# EasyEDA Pro project ProProject_ESP32-S3 Brewpiless V1 Rev 1_2024-01-04.epro

# Schematic esp32 brewpiless

## Sheets
1 ESP32
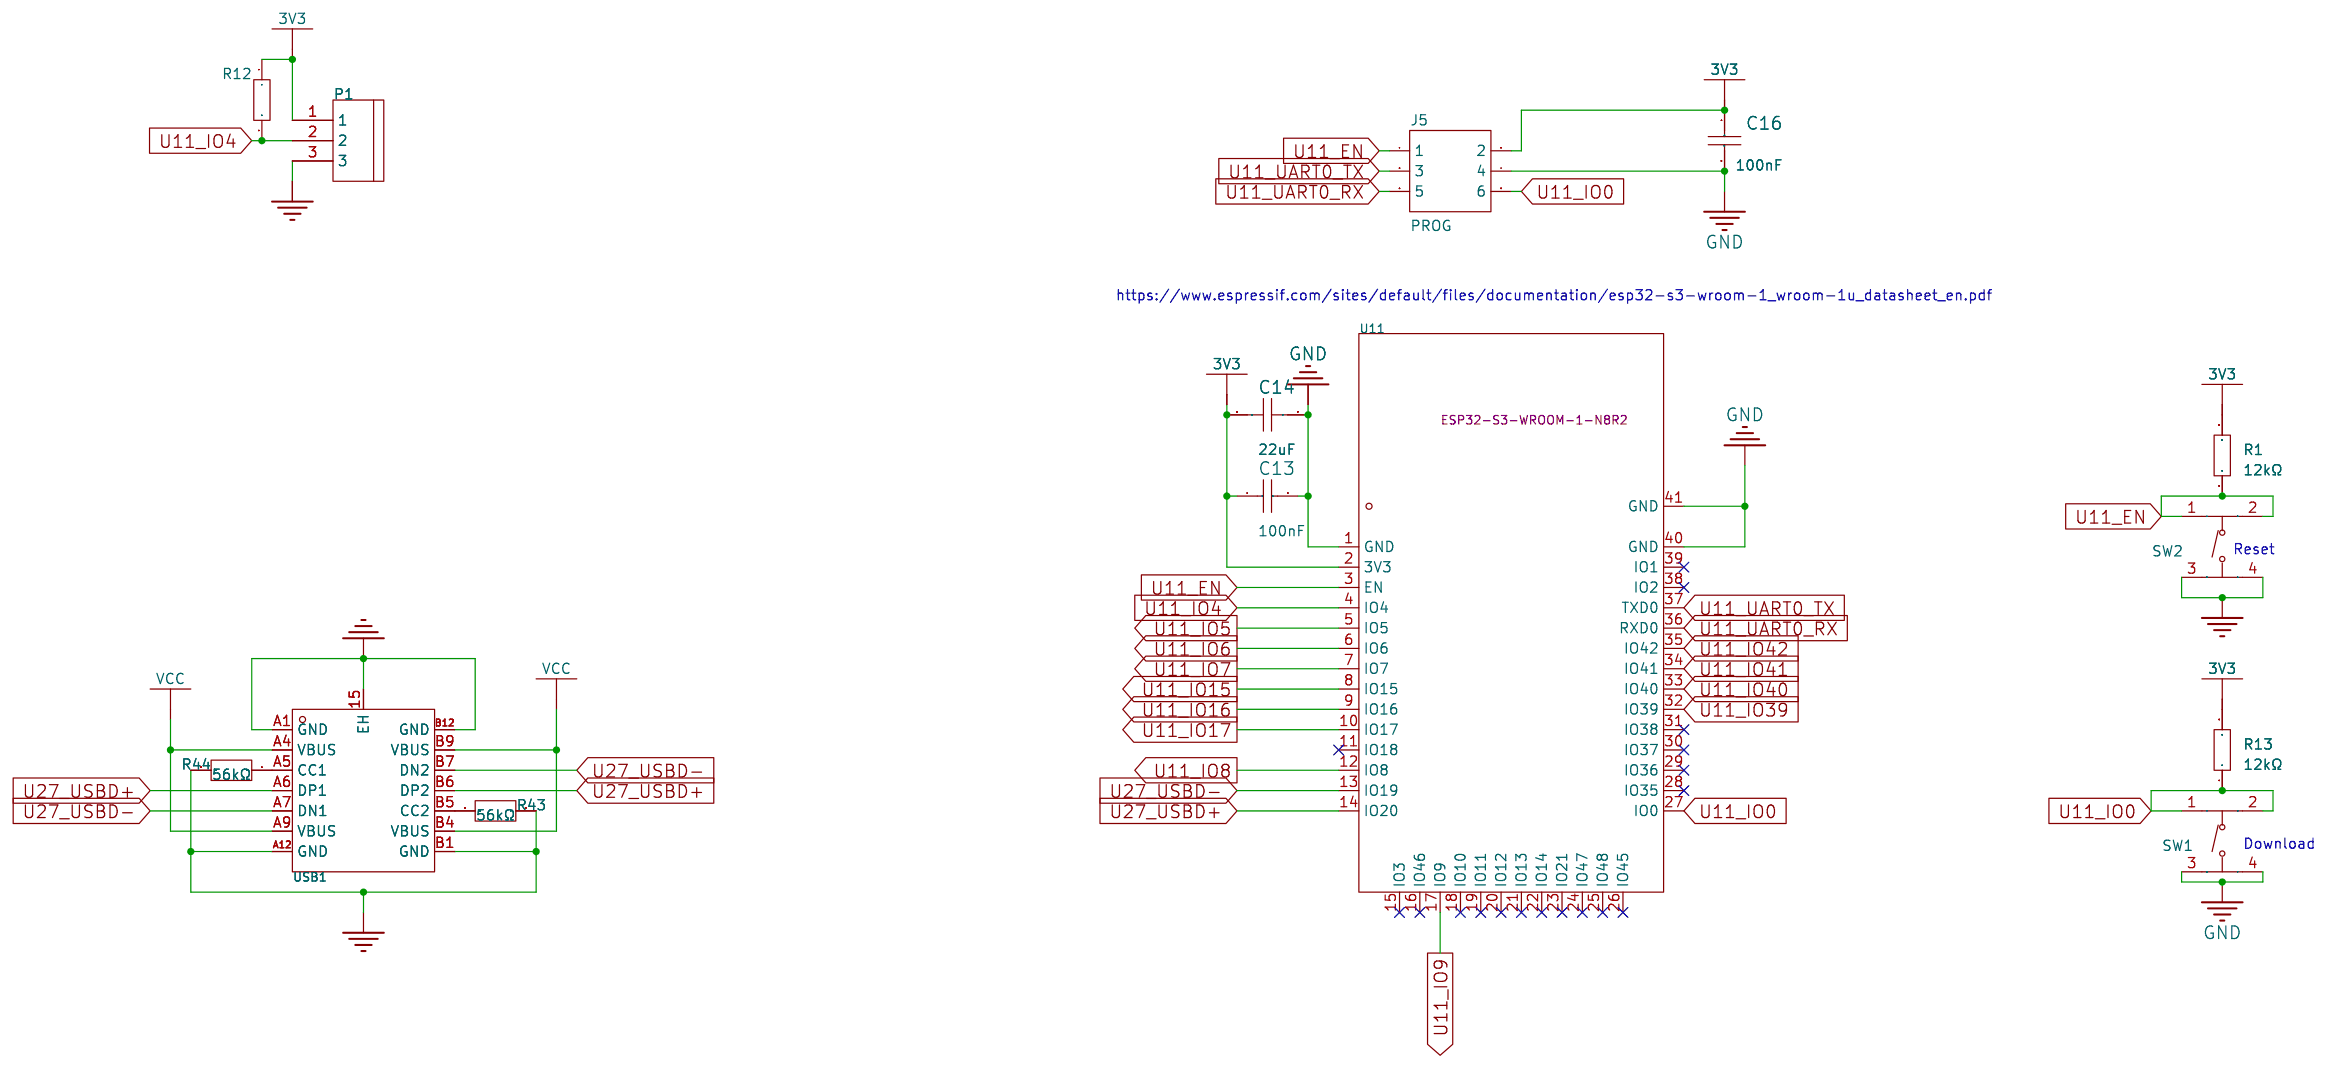
[diagram p0: ESP32]
2 Mains: Create Date: 2023-09-11; Page Name: Mains; Project Name: ESP8266 Brewpiless c6; Schematic Name: ESP32 Brewpiless; Update Date: 2024-01-02; Company: EasyEDA.com; Drawed: EasyEDAPro; Page Size: A4; Part Number: JLCPCB-002; Reviewed: EasyEDAPro; Version: V0.1
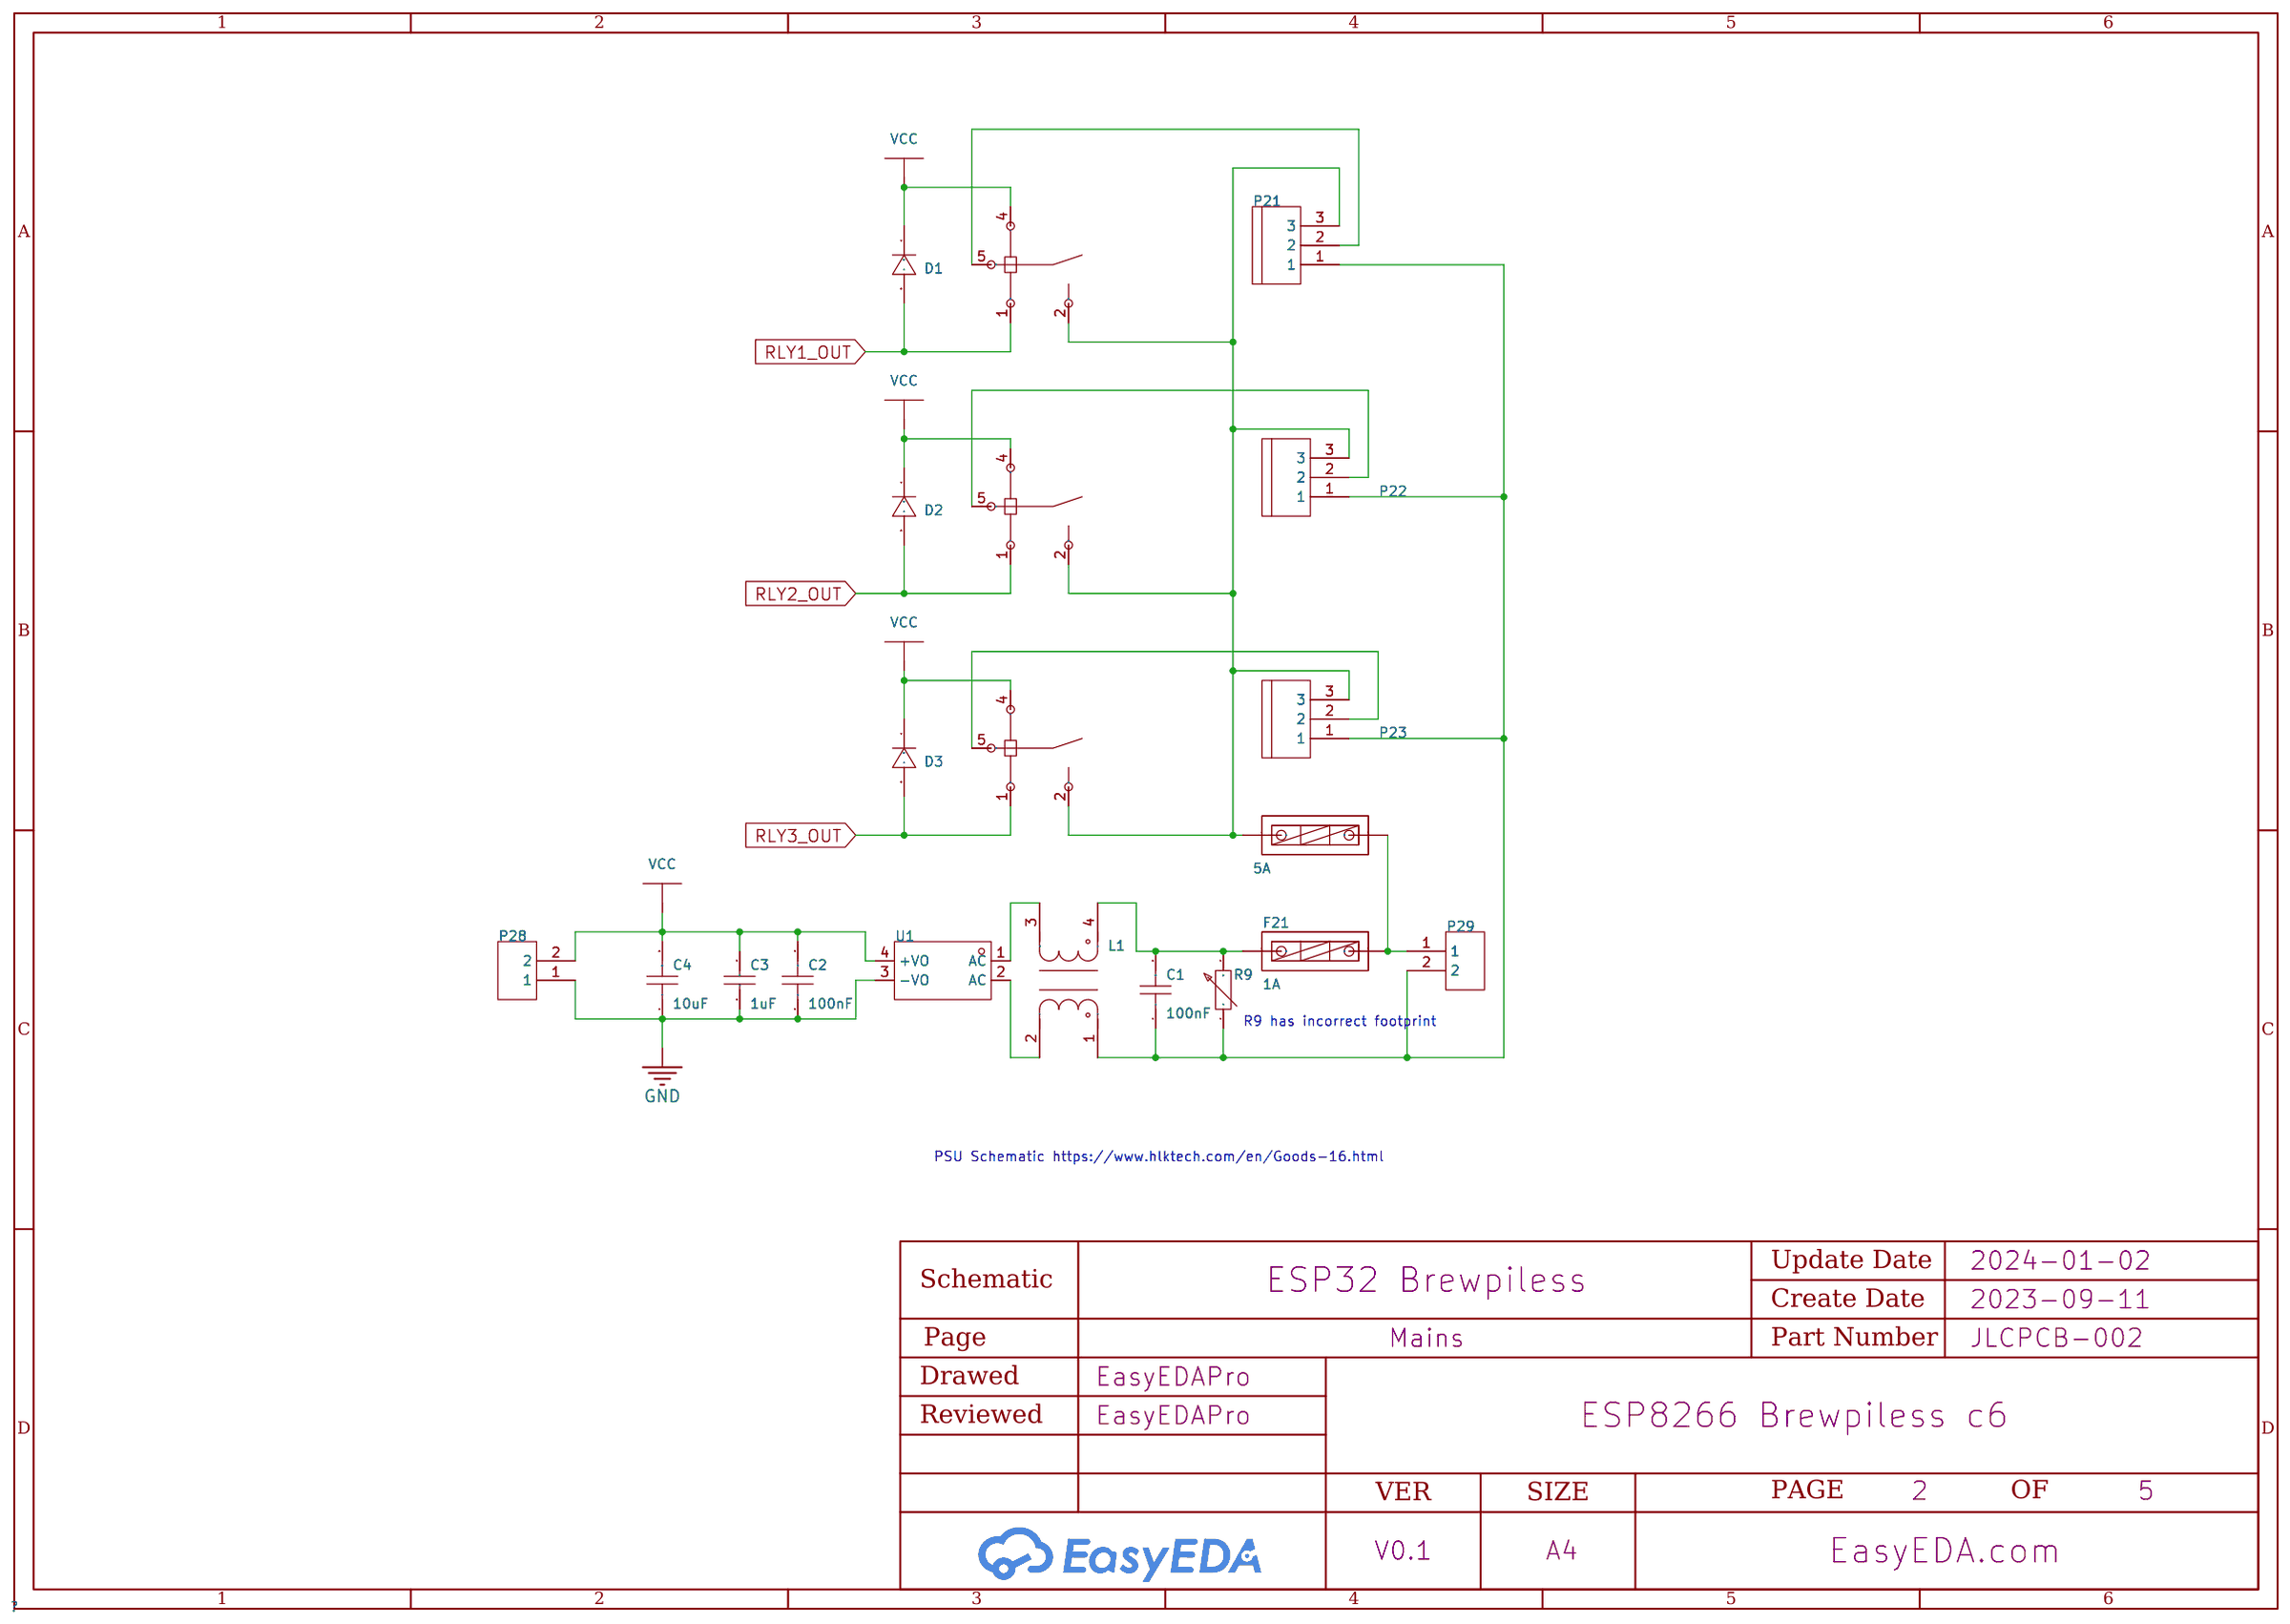
[diagram p1: Mains]
3 LevelShifter: Create Date: 2024-01-03; Page Name: LevelShifter; Project Name: ESP32-S3 Brewpiless V1 Rev 1; Schematic Name: esp32 brewpiless; Update Date: 2024-01-03; Company: EasyEDA.com; Drawed: EasyEDAPro; Page Size: A4; Part Number: JLCPCB-002; Reviewed: EasyEDAPro; Version: V0.1
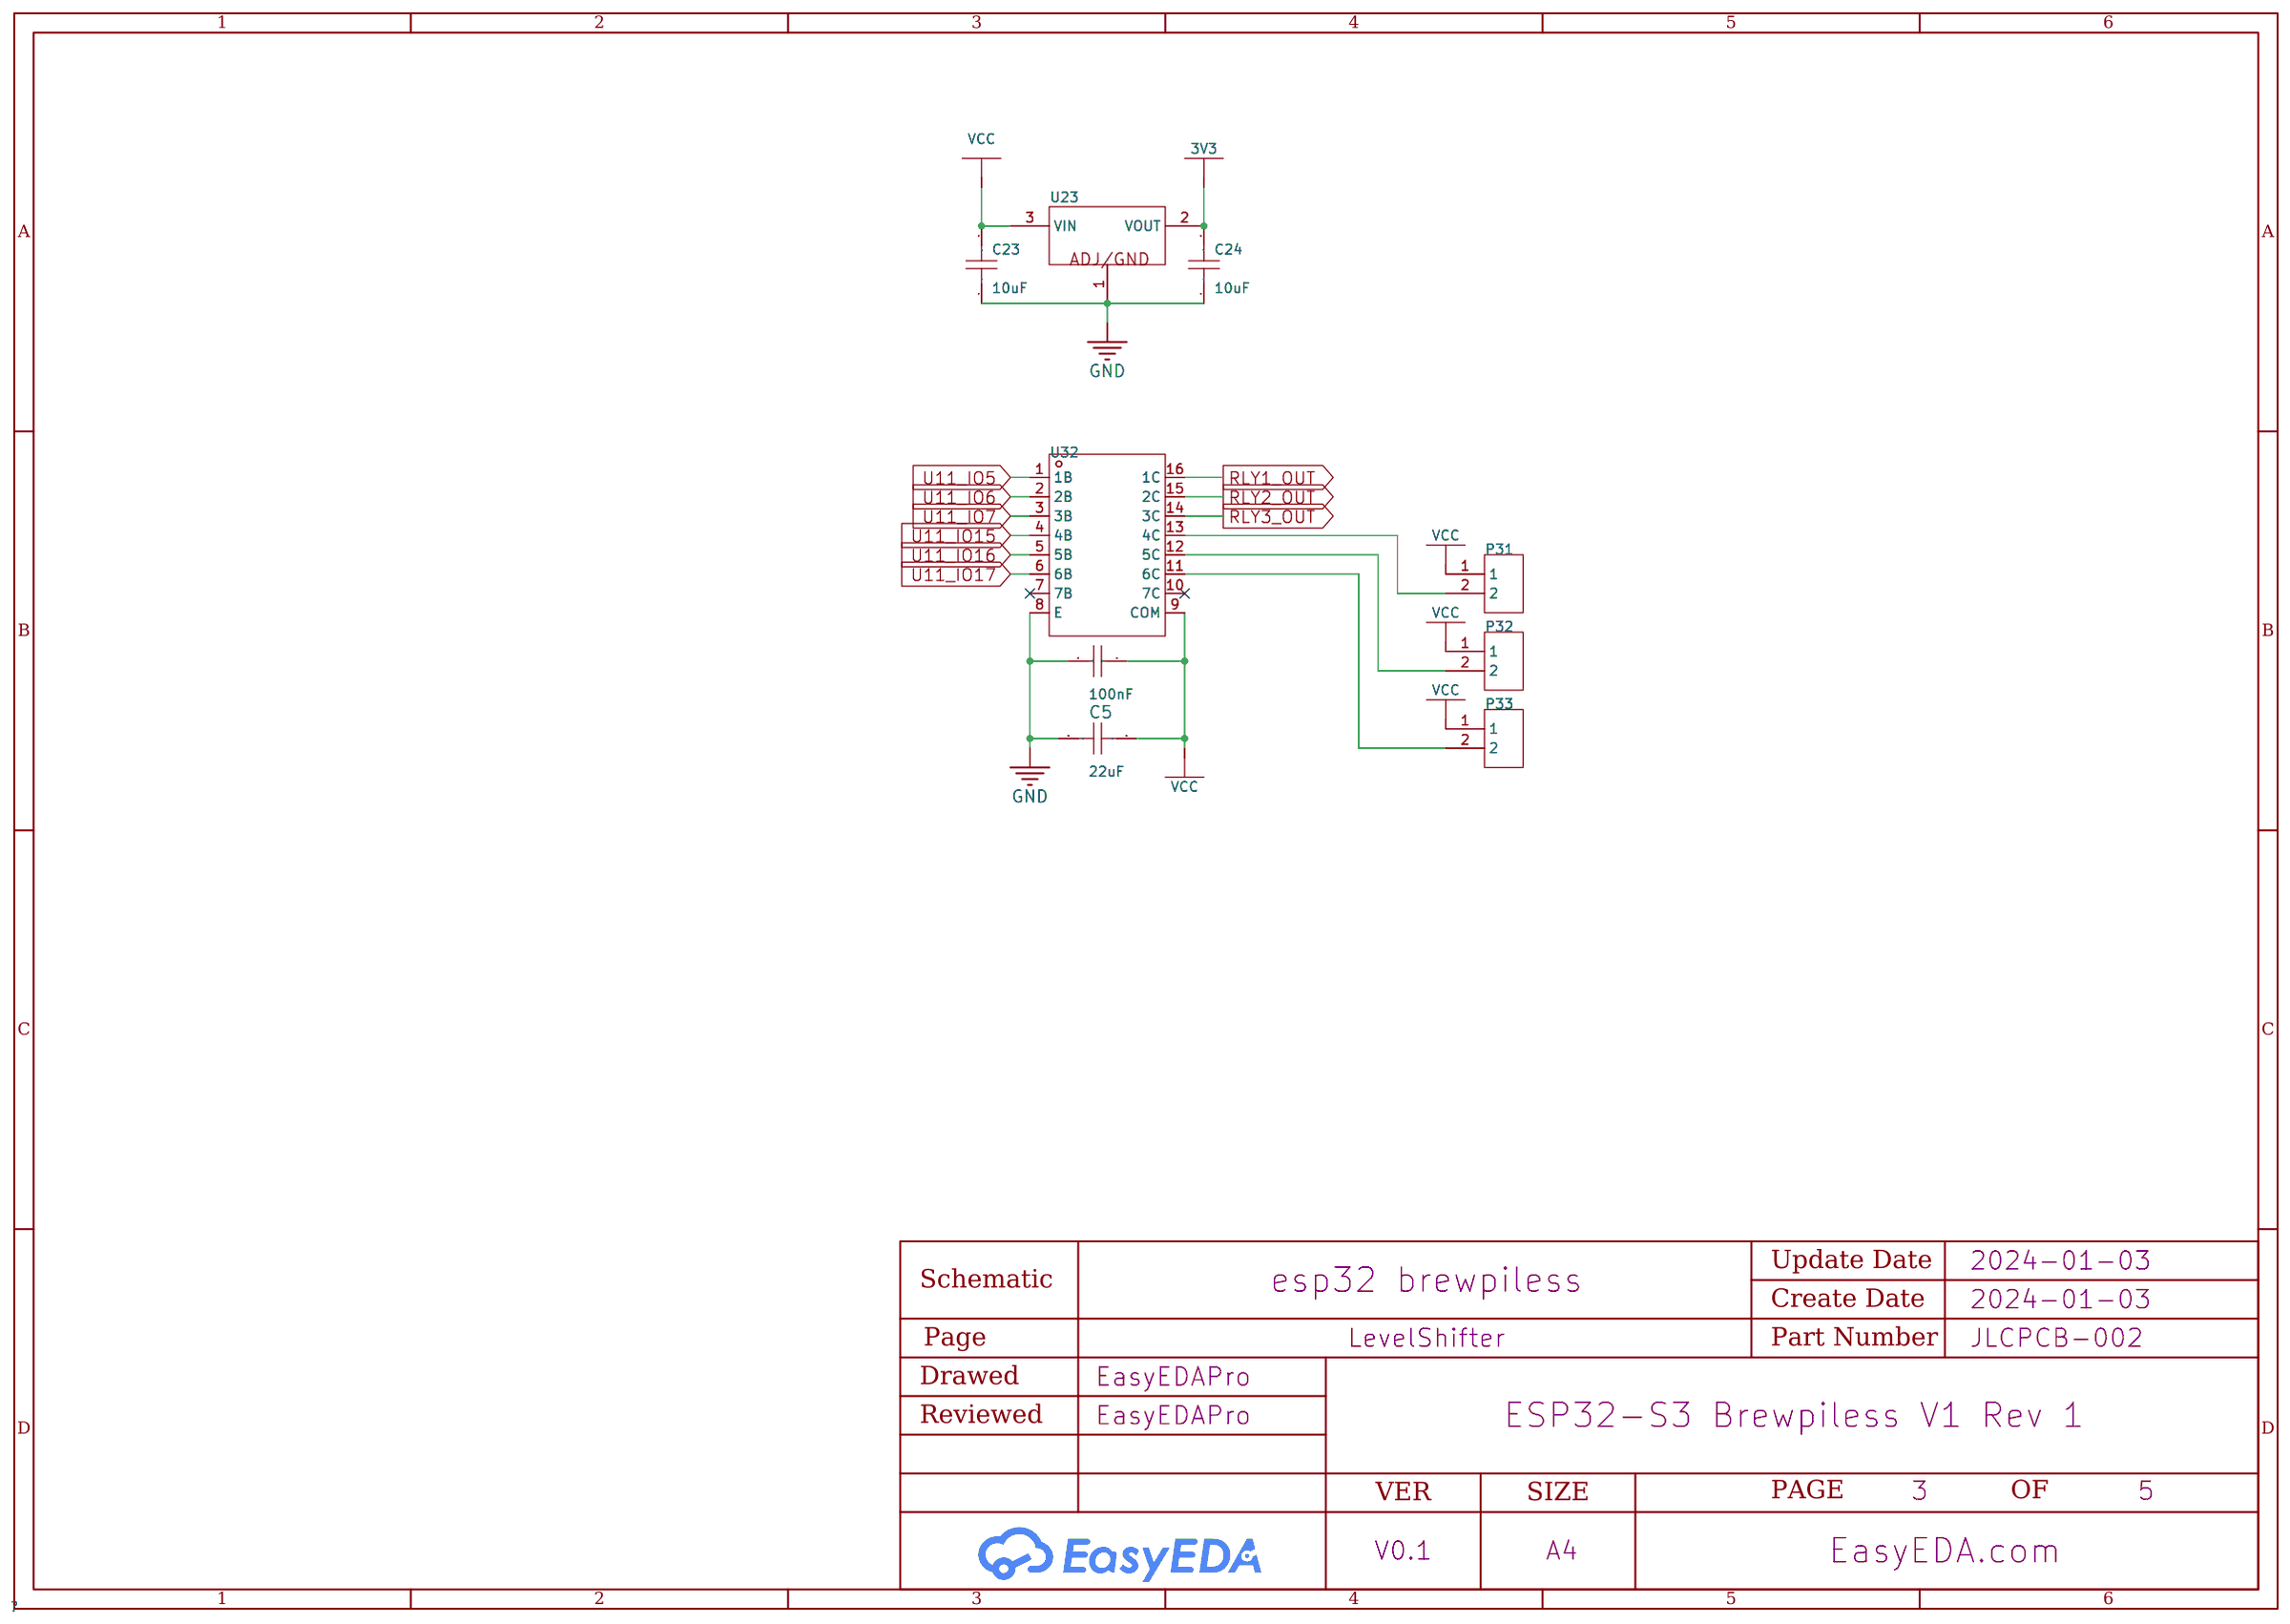
[diagram p2: LevelShifter]
4 RTD: Create Date: 2024-01-01; Page Name: RTD; Project Name: ESP8266 Brewpiless c6; Schematic Name: ESP32 Brewpiless; Update Date: 2024-01-02; Company: EasyEDA.com; Drawed: EasyEDA Pro; Page Size: A4; Part Number: JLCPCB-002; Reviewed: EasyEDA Pro; Version: V0.1
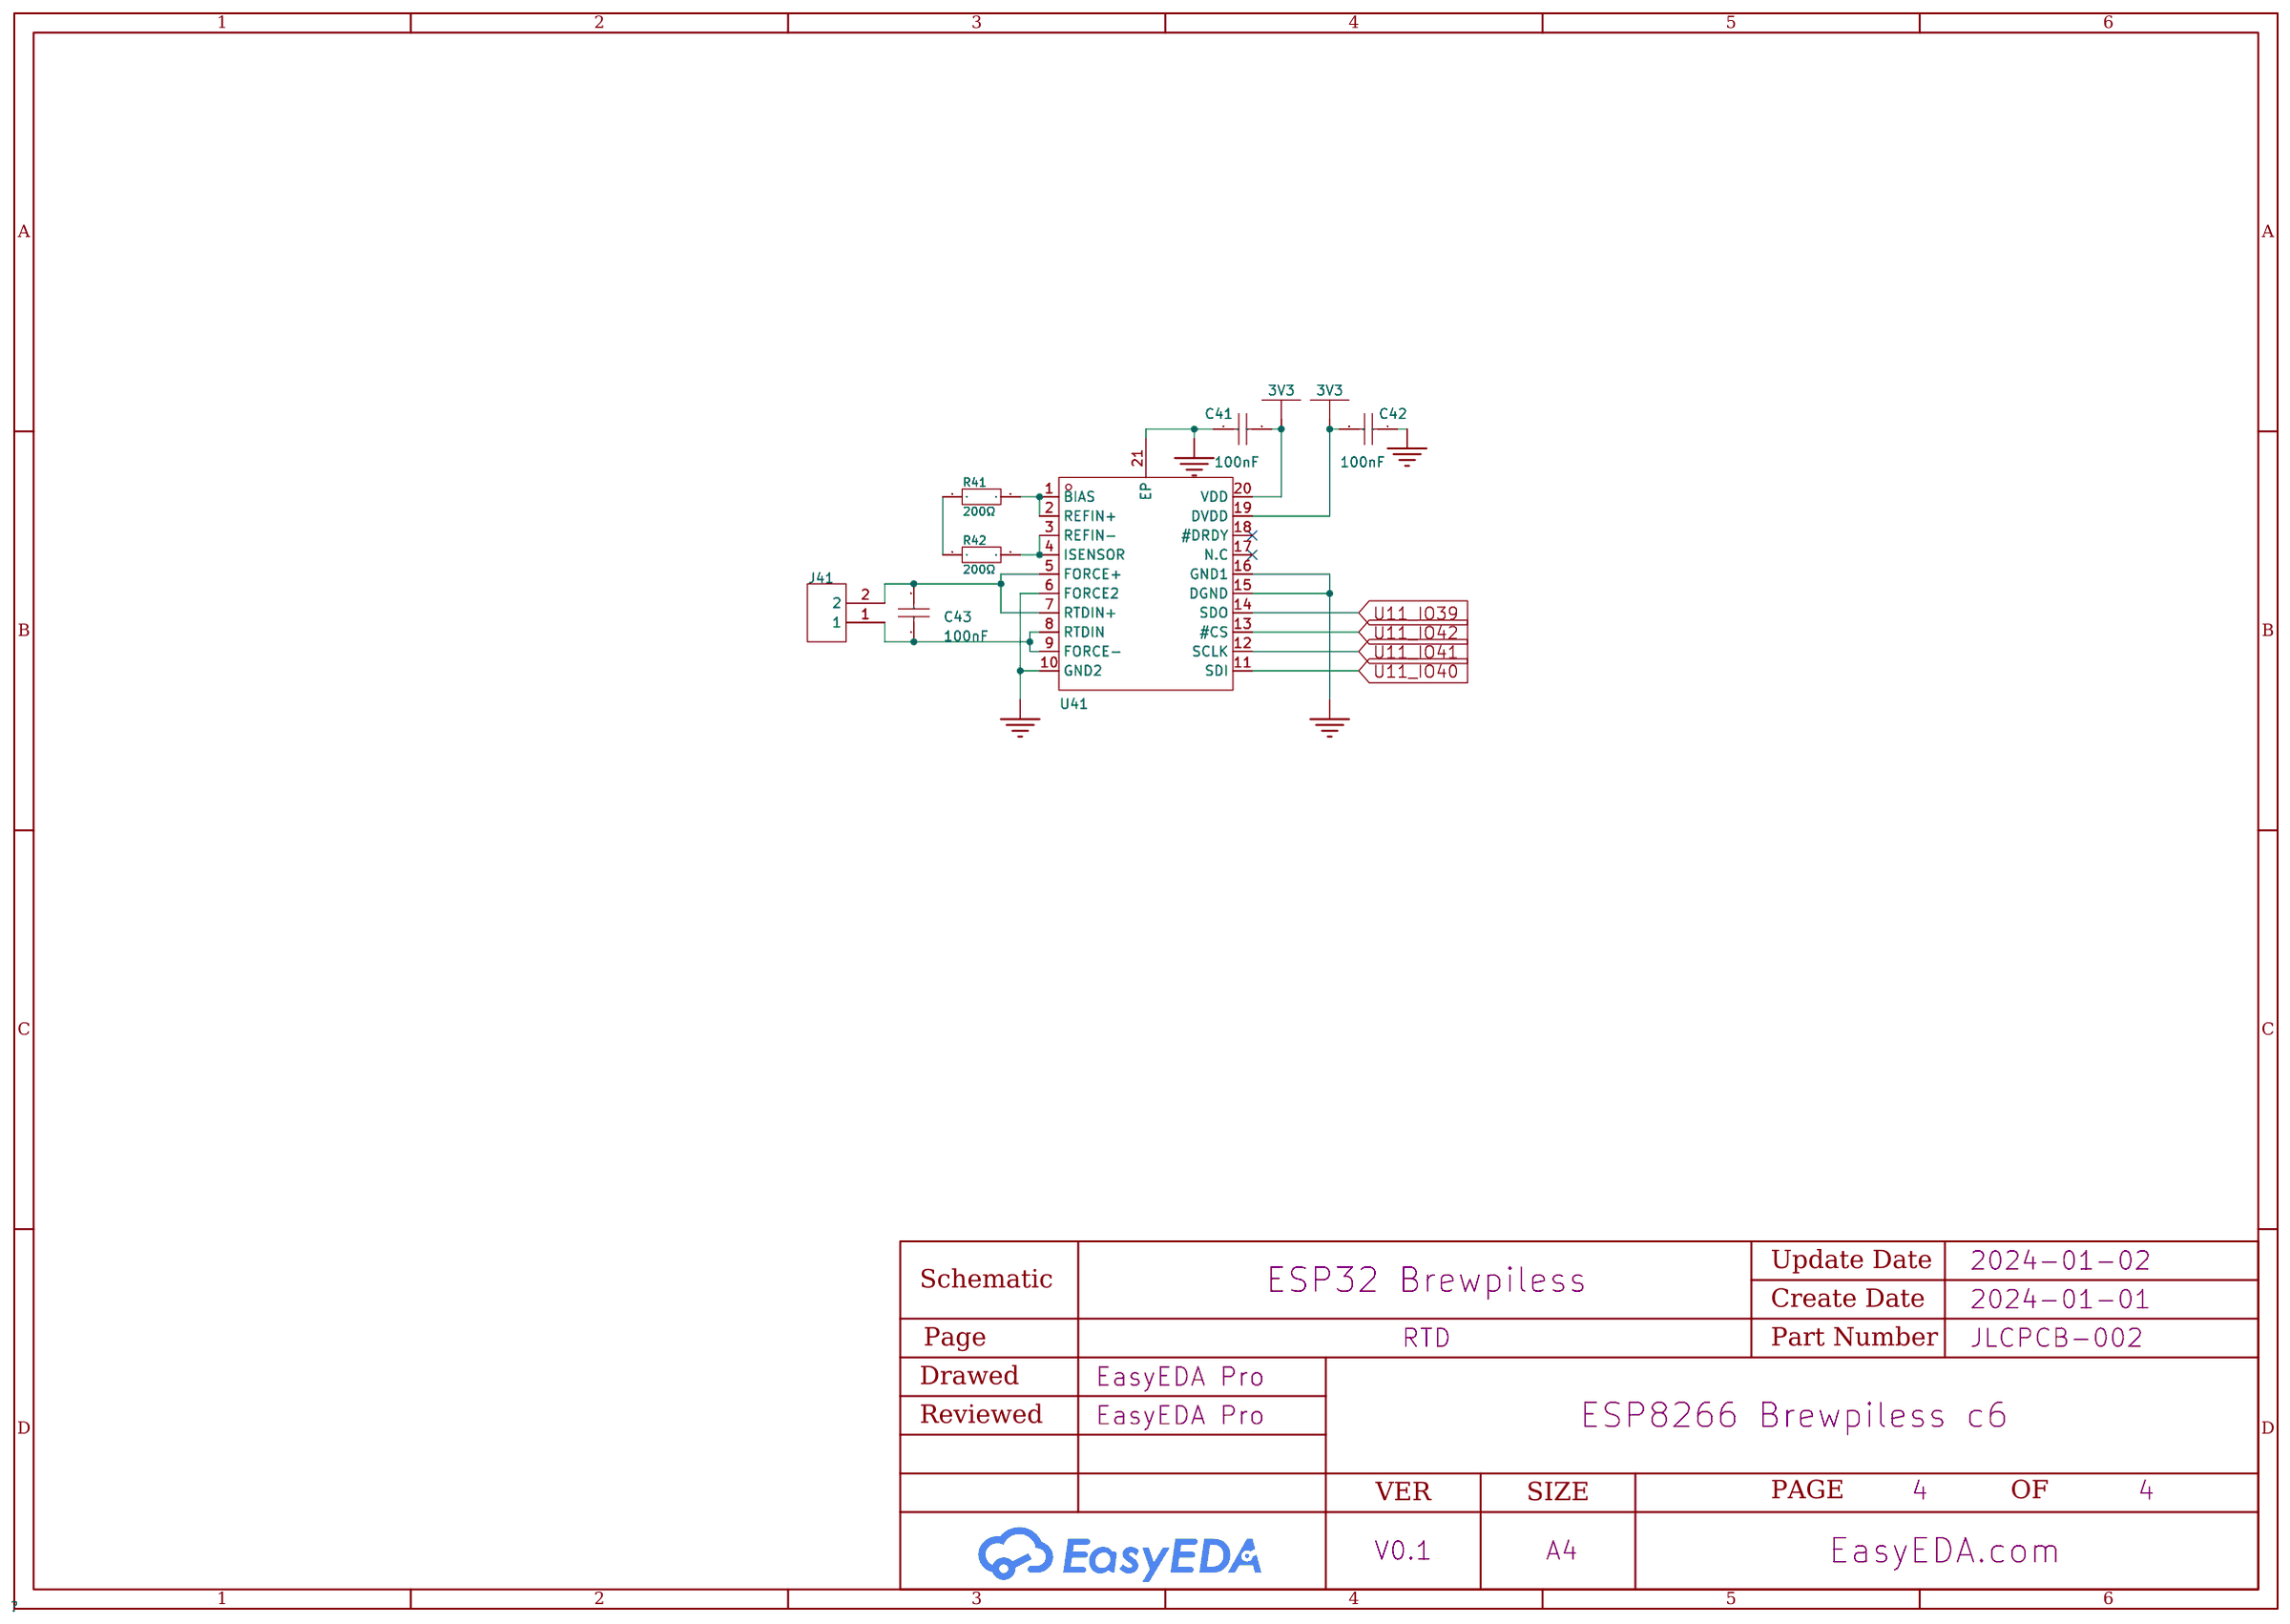
[diagram p3: RTD]
5 ATEC: Create Date: 2024-01-02; Page Name: ATEC; Project Name: ESP8266 Brewpiless c6; Schematic Name: ESP32 Brewpiless; Update Date: 2024-01-02; Company: EasyEDA.com; Drawed: EasyEDA Pro; Page Size: A4; Part Number: JLCPCB-002; Reviewed: EasyEDA Pro; Version: V0.1
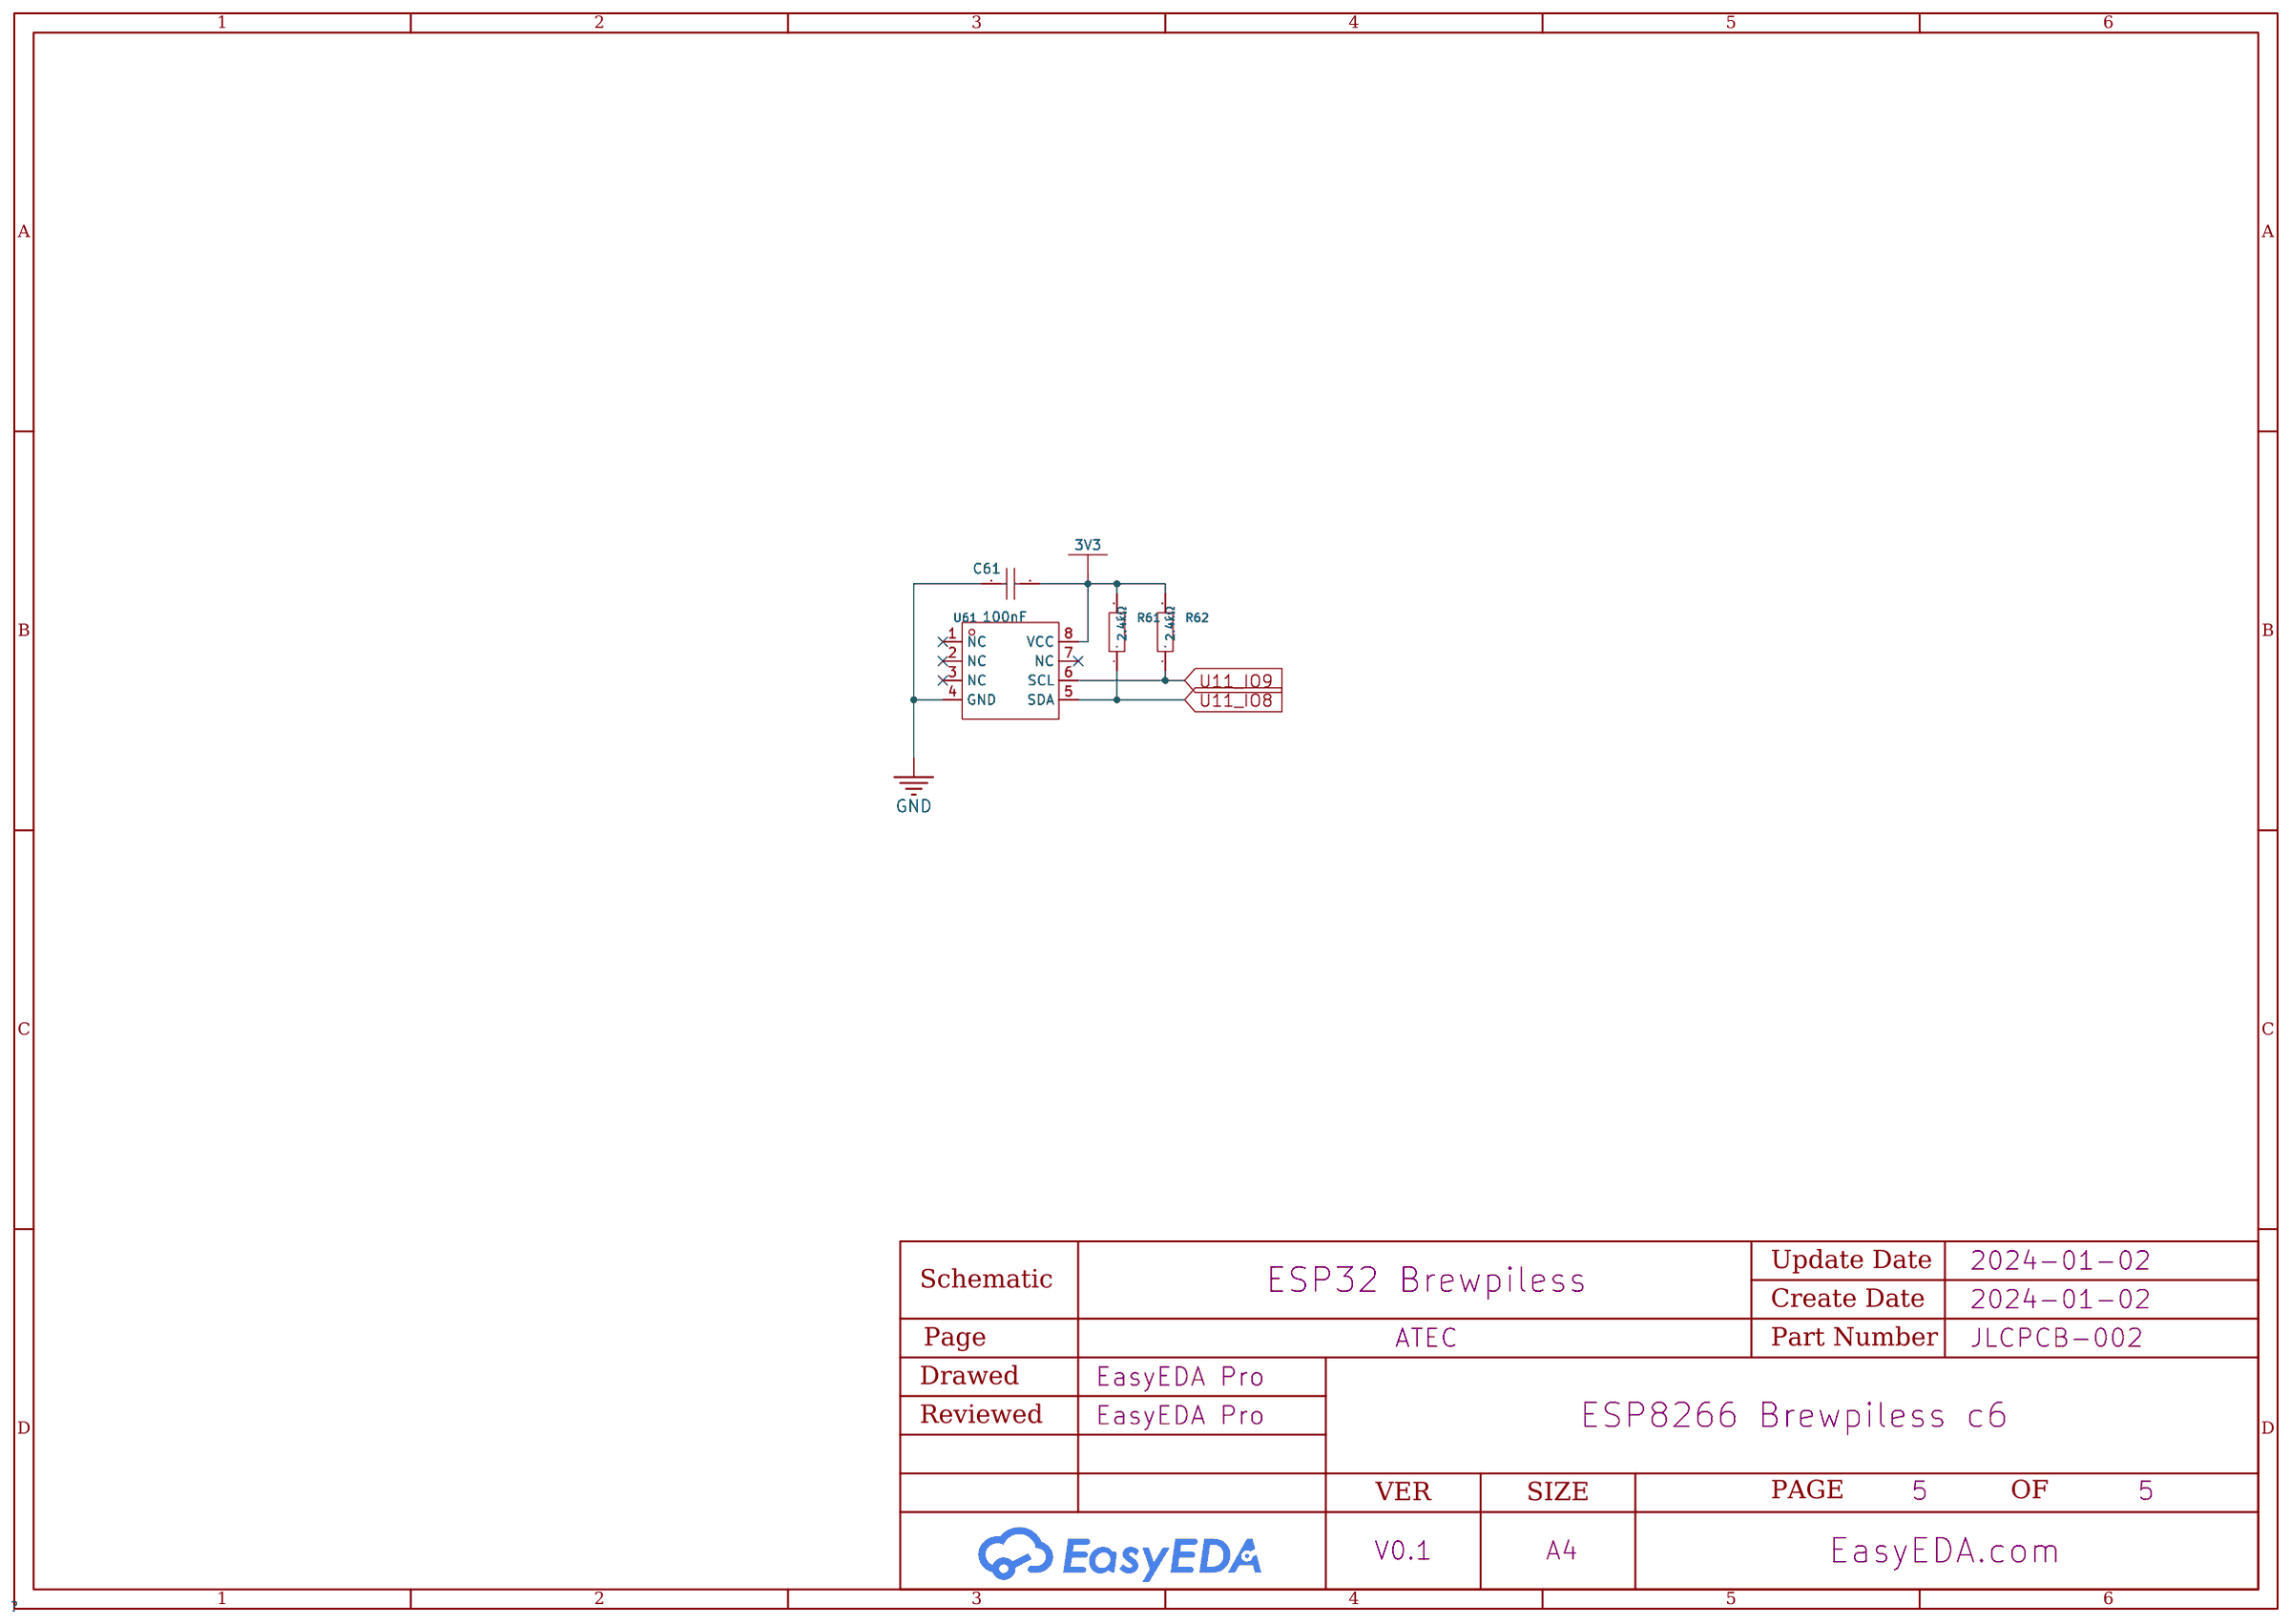
[diagram p4: ATEC]

## Parts
sheet ATEC
C61  100nF  [C0805]
R61  2.4kΩ  [R0805]
R62  2.4kΩ  [R0805]
U61  ATECC608A-SSHDA-T  [SOIC-8_L4.9-W3.9-P1.27-LS6.0-BL]
sheet ESP32
C13  100nF  [C0805]
C14  22uF  [C0805]
C16  100nF  [C0805]
J5  PROG  [IDC-TH_6P-P2.54_C11214]
P1  WJ500V-5.08-3P  [CONN-TH_3P-P5.00_WJ500V-5.08-3P]
R1  12kΩ  [R0805]
R12  4.7kΩ  [R0805]
R13  12kΩ  [R0805]
R43  56kΩ  [R0805]
R44  56kΩ  [R0805]
SW1  TS-1187A-B-A-B  [SW-SMD_4P-L5.1-W5.1-P3.70-LS6.5-TL-2]
SW2  TS-1187A-B-A-B  [SW-SMD_4P-L5.1-W5.1-P3.70-LS6.5-TL-2]
U11  2.4GHz  [WIRELM-SMD_ESP32-S3-WROOM-1]
USB1  TYPE-C 14P LTH10.0  [TYPE-C-SMD_918-468K2029Y50001]
sheet LevelShifter
C5  22uF  [C0805]
C22  100nF  [C0805]
C23  10uF  [C0805]
C24  10uF  [C0805]
P31  WJ500V-5.08-2P  [CONN-TH_2P-P5.00_WJ500V-5.08-2P]
P32  WJ500V-5.08-2P  [CONN-TH_2P-P5.00_WJ500V-5.08-2P]
P33  WJ500V-5.08-2P  [CONN-TH_2P-P5.00_WJ500V-5.08-2P]
U23  -  [TO-252-2_L6.6-W6.1-P4.57-LS9.9-TL-CW]
U32  -  [SOIC-16_L9.9-W3.9-P1.27-LS6.0-BL]
sheet Mains
C1  100nF  [CAP-TH_L12.0-W5.5-P10.00-D0.6]
C2  100nF  [CAP-TH_L12.0-W5.5-P10.00-D0.6]
C3  1uF  [C0805]
C4  10uF  [C0805]
D1  SM4007PL  [SOD-123F_L2.8-W1.8-LS3.7-RD]
D2  SM4007PL  [SOD-123F_L2.8-W1.8-LS3.7-RD]
D3  SM4007PL  [SOD-123F_L2.8-W1.8-LS3.7-RD]
F21  -  [FUSE-TH_5X20RHOSFUSECLIP-SEAT]
F22  5A  [FUSE-TH_5X20RHOSFUSECLIP-SEAT]
F210  1A  [FUSE-TH_5X20RHOSFUSECLIP-SEAT]
F220  10A  [FUSE-TH_5X20RHOSFUSECLIP-SEAT]
K1  -  [RELAY-TH_973-XXVDC-SL-A]
K2  -  [RELAY-TH_973-XXVDC-SL-A]
K3  -  [RELAY-TH_973-XXVDC-SL-A]
L1  -  [FILTER-TH_UU10.5Y-10MH]
P21  WJ500V-5.08-3P  [CONN-TH_3P-P5.00_WJ500V-5.08-3P]
P22  WJ500V-5.08-3P  [CONN-TH_3P-P5.00_WJ500V-5.08-3P]
P23  WJ500V-5.08-3P  [CONN-TH_3P-P5.00_WJ500V-5.08-3P]
P28  WJ500V-5.08-2P  [CONN-TH_2P-P5.00_WJ500V-5.08-2P]
P29  WJ500V-5.08-2P  [CONN-TH_2P-P5.00_WJ500V-5.08-2P]
R9  10D561K  [RES-TH_L13.0-W6.0-P7.50-D0.9-S6.00]
U1  -  [PWRM-TH_HLK-5M05]
sheet RTD
C41  100nF  [C0805]
C42  100nF  [C0805]
C43  100nF  [C0805]
J41  WJ500V-5.08-2P  [CONN-TH_2P-P5.00_WJ500V-5.08-2P]
R41  200Ω  [R0805]
R42  200Ω  [R0805]
U41  MAX31865ATP+T  [QFN-20_L5.0-W5.0-P0.65-BL-EP]

## Library data of the parts
C41-C43 C61 = CC0805KRX7R9BB104: Capacitance: Tolerance:±10% Tolerance:±10% Voltage Rated: Temperature Coefficient:; LCSC Part Name: 100nF ±10% 50V; Supplier Part: C49678; Manufacturer: YAGEO(国巨); Supplier Footprint: 0805; JLCPCB Part Class: Basic Part; Datasheet: https://atta.szlcsc.com/upload/public/pdf/source/20180224/C181747_15194369449651363981.pdf; Supplier: LCSC; Tolerance: ±10%; Voltage Rated: 450V; Operating Temperature: -40℃~+105℃
R61 R62 = 0805W8F2401T5E: Resistance:2400Ω Tolerance:±1% Tolerance:±1% Power(Watts): Overload Voltage (Max): Temperature Coefficient:±100ppm/℃ Temperature Coefficient:±100ppm/℃ Type:Thick Film Resistors Operating Temperature Range:-55℃~+155℃ Operating Temperature Range:-55℃~+155℃; LCSC Part Name: 2.4kΩ ±1% 125mW 厚膜电阻; Supplier Part: C17526; Manufacturer: UNI-ROYAL(厚声); Supplier Footprint: 0805; JLCPCB Part Class: Basic Part; Datasheet: https://atta.szlcsc.com/upload/public/pdf/source/20200306/C422600_1E6D84923E4A46A82E41ADD87F860B5C.pdf; Supplier: LCSC; Tolerance: ±1%; Temperature Coefficient: ±100ppm/℃; Type: Thick Film Resistors; Operating Temperature Range: -55℃~+155℃
U61 = ATECC608A-SSHDA-T_C616024: Supplier Part: C616024; Manufacturer: MICROCHIP(美国微芯); Supplier Footprint: SOP-8; JLCPCB Part Class: Extended Part; Datasheet: https://atta.szlcsc.com/upload/public/pdf/source/20211006/C2650407_D58AC76DEF233DF217701720610C6837.pdf; Supplier: LCSC
C13 C16 C22 = CC0805KRX7R9BB104: Capacitance: Tolerance:±10% Tolerance:±10% Voltage Rated: Temperature Coefficient:; LCSC Part Name: 100nF ±10% 50V; Supplier Part: C49678; Manufacturer: YAGEO(国巨); Supplier Footprint: 0805; JLCPCB Part Class: Basic Part; Datasheet: https://atta.szlcsc.com/upload/public/pdf/source/20180224/C181747_15194369449651363981.pdf; Supplier: LCSC; Tolerance: ±10%; Voltage Rated: 50V; Temperature Coefficient: X7R
C5 C14 = CL21A226MAQNNNE_C45783: Capacitance: Tolerance:±20% Tolerance:±20% Voltage Rated: Temperature Coefficient:; LCSC Part Name: 22uF ±20% 25V; Supplier Part: C45783; Manufacturer: SAMSUNG(三星); Manufacturer Part: CL21A226MAQNNNE; Supplier Footprint: 0805; JLCPCB Part Class: Basic Part; Datasheet: https://atta.szlcsc.com/upload/public/pdf/source/20160218/1457707763339.pdf; Supplier: LCSC; Tolerance: ±20%; Voltage Rated: 50V; Temperature Coefficient: Y5V
J5 = 2.54-2*3P简牛: Connector Type:简牛座 Pitch:2.54mm Number of Rows:2 Row Spacing:2.54mm Holder Type:直插 Contact Material:黄铜 Contact Plating:金; LCSC Part Name: 2.54mm 排数:2 2*3P; Supplier Part: C11214; Manufacturer: BOOMELE(博穆精密); Supplier Footprint: 插件,P=2.54mm; JLCPCB Part Class: Extended Part; Datasheet: https://atta.szlcsc.com/upload/public/pdf/source/20140331/1457707037652.pdf; Supplier: LCSC; Connector Type: 简牛座; Pitch: 2.54mm; Number of Rows: 2; Row Spacing: 2.54mm; Holder Type: 直插; Contact Material: 黄铜; Contact Plating: 金
P1 = WJ500V-5.08-3P: Pitch:5.08mm Structure:1x3P Number of Rows:1 Number of PINs Per Row:3 Mounting Style:Straight Current Rating (Max):18A Voltage Rating (Max):250V Wire Gauge - AWG:14~30 Wire Gauge - AWG:14~30 Wire Gauge - mm2:2.5 Wire Gauge - mm2:2.5 Operating Temperature; LCSC Part Name: 5.08mm 1x3P 排数:1 每排P数:3 直插 可拼接; Supplier Part: C72334; Manufacturer: KANGNEX(康奈克斯电气); Supplier Footprint: 插件,P=5.08mm; JLCPCB Part Class: Extended Part; Datasheet: https://atta.szlcsc.com/upload/public/pdf/source/20191225/C72334_8A5EF831D67650233B6B1E3F2BC06274.pdf; Supplier: LCSC; Pitch: 5.08mm; Structure: 1x3P; Number of Rows: 1; Number of PINs Per Row: 3; Mounting Style: Straight; Current Rating (Max): 18A; Voltage Rating (Max): 250V; Wire Gauge - AWG: 14~30; Wire Gauge - mm2: 2.5; Operating Temperature Range: -40℃~+105℃; Color: Green; Number of Pins: 3P; Wire Gauge - mm?: 2.5
R1 R13 = 0805W8F1202T5E: Resistance:12000Ω Tolerance:±1% Tolerance:±1% Power(Watts): Overload Voltage (Max): Temperature Coefficient:±100ppm/℃ Temperature Coefficient:±100ppm/℃ Type:Thick Film Resistors Operating Temperature Range:-55℃~+155℃ Operating Temperature Range:-55℃~+155℃; LCSC Part Name: 12kΩ ±1% 125mW 厚膜电阻; Supplier Part: C17444; Manufacturer: UNI-ROYAL(厚声); Supplier Footprint: 0805; JLCPCB Part Class: Basic Part; Datasheet: https://atta.szlcsc.com/upload/public/pdf/source/20200306/C422600_1E6D84923E4A46A82E41ADD87F860B5C.pdf; Supplier: LCSC; Tolerance: ±1%; Power(Watts): 1/3W; Overload Voltage (Max): 150V; Temperature Coefficient: ±100ppm/℃; Type: Thick Film Resistors; Operating Temperature Range: -55℃~+155℃
R12 = 0805W8F4701T5E: Resistance:4700Ω Tolerance:±1% Tolerance:±1% Power(Watts): Overload Voltage (Max): Temperature Coefficient:±100ppm/℃ Temperature Coefficient:±100ppm/℃ Type:Thick Film Resistors Operating Temperature Range:-55℃~+155℃ Operating Temperature Range:-55℃~+155℃; LCSC Part Name: 4.7kΩ ±1% 125mW 厚膜电阻; Supplier Part: C17673; Manufacturer: UNI-ROYAL(厚声); Supplier Footprint: 0805; JLCPCB Part Class: Basic Part; Datasheet: https://atta.szlcsc.com/upload/public/pdf/source/20200306/C422600_1E6D84923E4A46A82E41ADD87F860B5C.pdf; Supplier: LCSC; Tolerance: ±1%; Power(Watts): 125mW; Overload Voltage (Max): 150V; Temperature Coefficient: ±100ppm/℃; Type: Thick Film Resistors; Operating Temperature Range: -55℃~+155℃
R43 R44 = ARG05DTC5602: Type:Thin Film Resistor Resistance: Tolerance:±0.5% Tolerance:±0.5% Power(Watts): Temperature Coefficient:±25ppm/℃ Temperature Coefficient:±25ppm/℃ Overload Voltage (Max): Operating Temperature Range:-55℃~+155℃ Operating Temperature Range:-55℃~+155℃; LCSC Part Name: 56kΩ ±0.5% 125mW; Supplier Part: C2828780; Manufacturer: Viking(光颉); Supplier Footprint: 0805; JLCPCB Part Class: Extended Part; Datasheet: https://atta.szlcsc.com/upload/public/pdf/source/20210426/C2828737_35D2DDB0BDDA00747C2712435E28BBD4.pdf; Supplier: LCSC; Type: Thin Film Resistor; Tolerance: ±0.5%; Temperature Coefficient: ±25ppm/℃; Operating Temperature Range: -55℃~+155℃
SW1 SW2 = TS-1187A-B-A-B: Contact Current:50mA Voltage Rating (DC):12V Insulation Resistance:- Circuit:SPST Mounting Style:Brick nogging Actuator Style:Round Button Actuator/Cap Color:金色 With Lamp:No Operating Force:160gf Mechanical Life:100000次 Operating Temperature:-30℃~+85℃ Ope; LCSC Part Name: 5.1*5.1*1.5mm 立贴 轻触开关 防水金属头; Supplier Part: C318884; Manufacturer: XKB Connectivity(中国星坤); Supplier Footprint: SMD; JLCPCB Part Class: Basic Part; Datasheet: https://atta.szlcsc.com/upload/public/pdf/source/20200227/C318884_1F20165719E1C4CAA3E10C4C359C6E26.pdf; Supplier: LCSC; Contact Current: 50mA; Voltage Rating (DC): 12V; Circuit: SPST; Mounting Style: Brick nogging; Actuator Style: Round Button; Actuator/Cap Color: 金色; With Lamp: No; Operating Force: 160gf; Mechanical Life: 100000次; Operating Temperature: -30℃~+85℃; Switch Length: 5.1mm; Switch Width: 5.1mm; Switch Height: 1.5mm; Strike Gundam: NO; Pin Style: SMD接片
U11 = ESP32-S3-WROOM-1-N8R2: Core Processor:ESP32-S3芯片 Support Interface:I2C；GPIO；SPI；PWM；ADC；UART；USB；I2S Frequency:2.4GHz; LCSC Part Name: 通用型Wi-Fi+低功耗蓝牙MCU模组; Supplier Part: C2913204; Manufacturer: ESPRESSIF(乐鑫); Supplier Footprint: SMD,18x25.5mm; JLCPCB Part Class: Extended Part; Datasheet: https://atta.szlcsc.com/upload/public/pdf/source/20220628/A2AC12B3C87735CAEB7EBE2DBE80936C.pdf; Supplier: LCSC; Core Processor: ESP32-S3芯片; Support Interface: I2C；GPIO；SPI；PWM；ADC；UART；USB；I2S
USB1 = TYPE-C 14P LTH10.0: Connector Type:Type-C Gender:Female Number of Contacts:14P Number of Ports:1 Mounting Style:Brick nogging Current Rating - Power (Max):5A Operating Temperature Range:-40℃~+85℃ Operating Temperature Range:-40℃~+85℃; LCSC Part Name: Type-C 母 立贴; Supplier Part: C5187467; Manufacturer: SHOU HAN(首韩); Supplier Footprint: SMD; JLCPCB Part Class: Extended Part; Datasheet: https://atta.szlcsc.com/upload/public/pdf/source/20220929/372BD15DA7BF2B0C3EB7CA3B355D320D.pdf; Supplier: LCSC; Connector Type: Type-C; Gender: Female; Number of Contacts: 14P; Number of Ports: 1; Mounting Style: Brick nogging; Current Rating - Power (Max): 5A; Operating Temperature Range: -40℃~+85℃
C4 C23 C24 = GRM21BR61H106KE43L: Capacitance: Tolerance:±10% Tolerance:±10% Voltage Rated: Temperature Coefficient:; LCSC Part Name: 10uF ±10% 50V; Supplier Part: C440198; Manufacturer: muRata(村田); Supplier Footprint: 0805; JLCPCB Part Class: Basic Part; Datasheet: https://atta.szlcsc.com/upload/public/pdf/source/20230811/95AAE0C9AF55EDC31B7A4D8B733F534E.pdf; Supplier: LCSC; Tolerance: ±10%; Voltage Rated: 16V; Temperature Coefficient: X5R
J41 P28 P29 P31-P33 = WJ500V-5.08-2P: Pitch:5.08mm Structure:1x2P Number of Rows:1 Number of PINs Per Row:2 Mounting Style:Straight Current Rating (Max):18A Voltage Rating (Max):250V Wire Gauge - AWG:14~30 Wire Gauge - AWG:14~30 Wire Gauge - mm2:2.5 Wire Gauge - mm2:2.5 Operating Temperature; LCSC Part Name: 5.08mm 1x2P 排数:1 每排P数:2 直插 可拼接; Supplier Part: C8465; Manufacturer: KANGNEX(康奈克斯电气); Supplier Footprint: 插件,P=5.08mm; JLCPCB Part Class: Extended Part; Datasheet: https://atta.szlcsc.com/upload/public/pdf/source/20191225/C8465_02D34CE5B5B4A53DF5891601D97FA9F4.pdf; Supplier: LCSC; Pitch: 5.08mm; Structure: 1x2P; Number of Rows: 1; Number of PINs Per Row: 2; Mounting Style: Straight; Current Rating (Max): 18A; Voltage Rating (Max): 250V; Wire Gauge - AWG: 14~30; Wire Gauge - mm2: 2.5; Operating Temperature Range: -40℃~+105℃; Color: Green; Number of Pins: 2P; Wire Gauge - mm?: 1.5
U23 = LM1117RS-3.3: OutputType:固定OutputPolarity:正NumberofOutputs:1MaximumInputVoltage:12VOutputVoltage:3.3VOutputVoltage:3.3VDropoutVoltage:1.3V@(1A)OutputCurrent:1APowerSupplyRejectionRatio(PRSS):75dB@(120Hz); LCSC Part Name: Vin=12VVout=3.3V1A75dB@(120Hz); Supplier Part: C126023; Manufacturer: HTC; Supplier Footprint: TO-252-2(DPAK); JLCPCB Part Class: ExtendedPart; Datasheet: https://atta.szlcsc.com/upload/public/pdf/source/20170814/C126023_1502678372096885895.pdf; Supplier: LCSC; Output Type: 固定; Output Polarity: 正; Number of Outputs: 1; Maximum Input Voltage: 12V; Output Voltage: 3.3V; Dropout Voltage: 1.3V@(1A); Output Current: 1A; Power Supply Rejection Ratio (PRSS): 75dB@(120Hz)
U32 = ULN2003ADR: Supplier Part: C7512; Manufacturer: TI(德州仪器); Supplier Footprint: SOIC-16_150mil; JLCPCB Part Class: BasicPart; Datasheet: https://atta.szlcsc.com/upload/public/pdf/source/20140704/1457707116045.pdf; Supplier: LCSC
C1 = MPP104J2W10AJ22620: Capacitance:100nF Tolerance:±5% Tolerance:±5% Voltage Rated:450V Operating Temperature:-40~+105 Operating Temperature:-40~+105; LCSC Part Name: 100nF±5%450VCBB22(MPP)金属化聚丙烯膜电容器; Supplier Part: C506846; Manufacturer: KNSCHA(科尼盛); Supplier Footprint: 径向引线,P=10mm; JLCPCB Part Class: ExtendedPart; Datasheet: https://atta.szlcsc.com/upload/public/pdf/source/20200331/C506846_A55F5C13A66FE116FD53E25D5158208D.pdf; Supplier: LCSC; Tolerance: ±5%; Voltage Rated: 450V; Operating Temperature: -40~+105
C2 = MPP104J2W10AJ22620: Capacitance: Tolerance:±5% Tolerance:±5% Voltage Rated: Operating Temperature:-40℃~+105℃ Operating Temperature:-40℃~+105℃; LCSC Part Name: 100nF ±5% 450V; Supplier Part: C506846; Manufacturer: KNSCHA(科尼盛); Supplier Footprint: 插件,P=10mm; JLCPCB Part Class: Extended Part; Datasheet: https://atta.szlcsc.com/upload/public/pdf/source/20200331/C506846_A55F5C13A66FE116FD53E25D5158208D.pdf; Supplier: LCSC; Tolerance: ±5%; Voltage Rated: 450V; Operating Temperature: -40℃~+105℃
C3 = CL21B105KBFNNNE: Capacitance: Tolerance:±10% Tolerance:±10% Voltage Rated: Temperature Coefficient:; LCSC Part Name: 1uF ±10% 50V; Supplier Part: C28323; Manufacturer: SAMSUNG(三星); Supplier Footprint: 0805; JLCPCB Part Class: Basic Part; Datasheet: https://atta.szlcsc.com/upload/public/pdf/source/20160218/1457707763339.pdf; Supplier: LCSC; Tolerance: ±10%; Voltage Rated: 50V; Temperature Coefficient: Y5V
D1-D3 = SM4007PL_C64898: Diode Configuration: Forward Voltage (Vf@If):1.1V@1A Reverse Voltage (Vr): Average Rectified Current (Io): Reverse Leakage Current:10uA@1kV; LCSC Part Name: 电压:1kV 电流:1A; Supplier Part: C64898; Manufacturer: MDD; Supplier Footprint: SOD-123FL; JLCPCB Part Class: Basic Part; Datasheet: https://atta.szlcsc.com/upload/public/pdf/source/20230823/16A8FDE162764C9B685A3717F2DA3690.pdf; Supplier: LCSC; Diode Configuration: 独立式; Forward Voltage (Vf@If): 1.1V@1A; Reverse Voltage (Vr): 400V; Average Rectified Current (Io): 1A; Reverse Leakage Current: 10uA@1kV
F21 F22 F210 F220 = 5x20 环保 保险管夹/座: FuseholderType:-FuseType:-ForUseWith/RelatedProducts:-FuseSize:-NumberofCircuits:-VoltageRating:-CurrentRating:-MountingType:-ContactMaterial:-ContactFinish:-; LCSC Part Name: 5x20保险管夹/座; Supplier Part: C3130; Manufacturer: xcfuse(旭程); Manufacturer Part: 5x20环保保险管夹/座; Supplier Footprint: 5x20; JLCPCB Part Class: ExtendedPart; Datasheet: https://atta.szlcsc.com/upload/public/pdf/source/20201204/C3130_0BBF31010F20A3F0EEDE0C51B760226B.pdf; Supplier: LCSC
K1-K3 = 973-5VDC-SL-A 15A250VAC: RelayType:GeneralPurposeCoilType:NonLatchingCoilVoltage:5VDCContactForm:SPSTContactRating(Current):15ASwitchingVoltage:(277VAC,110VDC)Max; LCSC Part Name: 功率继电器; Supplier Part: C396951; Manufacturer: NHC(汇龙仓); Manufacturer Part: 973-5VDC-SL-A15A250VAC; Supplier Footprint: 插件; JLCPCB Part Class: ExtendedPart; Datasheet: https://atta.szlcsc.com/upload/public/pdf/source/20190620/C396951_1D25D7C8B8509A9E6050155B4FA2087A.pdf; Supplier: LCSC; Relay Type: GeneralPurpose; Coil Type: NonLatching; Coil Voltage: 5VDC; Contact Form: SPST; Contact Rating (Current): 15A; Switching Voltage: (277VAC,110VDC)Max
L1 = UU10.5Y-10mH: NumberofLines:2Inductance@Frequency:10mH@1kHzDCResistance(DCR):750mΩ; LCSC Part Name: 10mH@1kHz; Supplier Part: C75196; Manufacturer: FH(风华); Supplier Footprint: ThroughHole; JLCPCB Part Class: ExtendedPart; Datasheet: https://atta.szlcsc.com/upload/public/pdf/source/20201015/C75196_9D901360C20AB97143C25AF7B779C5AC.pdf; Supplier: LCSC; Number of Lines: 2; Inductance @ Frequency: 10mH@1kHz; DC Resistance (DCR): 750mΩ
P21-P23 = WJ500V-5.08-3P: Pitch:5.08mm Structure:1x3P Number of Rows:1 Number of PINs Per Row:3 Mounting Style:Straight Current Rating (Max):18A Voltage Rating (Max):250V Wire Gauge - AWG:14~30 Wire Gauge - AWG:14~30 Wire Gauge - mm2:2.5 Wire Gauge - mm2:2.5 Operating Temperature; LCSC Part Name: 5.08mm 1x3P 排数:1 每排P数:3 直插 可拼接; Supplier Part: C72334; Manufacturer: KANGNEX(康奈克斯电气); Supplier Footprint: 插件,P=5.08mm; JLCPCB Part Class: Extended Part; Datasheet: https://atta.szlcsc.com/upload/public/pdf/source/20191225/C72334_8A5EF831D67650233B6B1E3F2BC06274.pdf; Supplier: LCSC; Pitch: 5.08mm; Structure: 1x3P; Number of Rows: 1; Number of PINs Per Row: 3; Mounting Style: Straight; Current Rating (Max): 18A; Voltage Rating (Max): 250V; Wire Gauge - AWG: 14~30; Wire Gauge - mm2: 2.5; Operating Temperature Range: -40℃~+105℃; Color: Green; Number of Pins: 3P; Mounting Sytle: 直针; Wire Gauge - mm?: 2.5
R9 = 10D561K_C113236: Allowable Voltage (AC): Allowable Voltage (DC): Varistor Voltage:504V~616V Varistor Voltage:504V~616V Clamping Voltage: Peak Current: Maximum Energy:42.3J Maximum Energy:42.3J Typical Capatitance:180pF@1kHz; LCSC Part Name: 插件 920V 42.3焦耳; Supplier Part: C113236; Manufacturer: HEL(鸿志); Supplier Footprint: 插件; JLCPCB Part Class: Extended Part; Datasheet: https://atta.szlcsc.com/upload/public/pdf/source/20170525/1495704231014.pdf; Supplier: LCSC; Allowable Voltage (AC): 350V; Allowable Voltage (DC): 460V; Varistor Voltage: 504V~616V; Clamping Voltage: 920V; Peak Current: 2.5kA; Maximum Energy: 42.3J; Typical Capatitance: 180pF@1kHz
U1 = HLK-5M05: ConversionType:AC-DCFunction:降压型IsolatedOrVoltageRegulation:隔离稳压OutputChannel:1InputVoltage(AC):90VAC~265VACInputVoltage(AC):90VAC~265VACInputVoltage(DC):120V~350VInputVoltage(DC):120V~350VOutputVoltage:5VOutputVoltage:5VOutputCurren; LCSC Part Name: Vin=90VAC~265VACVin=120V~350VVout=5V1A; Supplier Part: C209907; Manufacturer: HI-LINK(海凌科); Supplier Footprint: 插件; JLCPCB Part Class: ExtendedPart; Datasheet: https://atta.szlcsc.comnull; Supplier: LCSC; Conversion Type: AC-DC; Function: 降压型; Isolated Or Voltage Regulation: 隔离稳压; Output Channel: 1; Input Voltage(AC): 90VAC~265VAC; Input Voltage(DC): 120V~350V; Output Voltage: 5V; Output Current (Max): 1A; Output Power: 5W; Insulated Voltage: 3kV@AC; Conversion Efficiency: 69%; Feature: 过流保护；短路保护
R41 R42 = 0805W8F2000T5E: Resistance: Tolerance:±1% Tolerance:±1% Power(Watts): Overload Voltage (Max): Temperature Coefficient:±100ppm/℃ Temperature Coefficient:±100ppm/℃ Type:Thick Film Resistors Operating Temperature Range:-55℃~+155℃ Operating Temperature Range:-55℃~+155℃; LCSC Part Name: 200Ω ±1% 125mW 厚膜电阻; Supplier Part: C17540; Manufacturer: UNI-ROYAL(厚声); Supplier Footprint: 0805; JLCPCB Part Class: Basic Part; Datasheet: https://atta.szlcsc.com/upload/public/pdf/source/20200306/C422600_1E6D84923E4A46A82E41ADD87F860B5C.pdf; Supplier: LCSC; Tolerance: ±1%; Temperature Coefficient: ±100ppm/℃; Type: Thick Film Resistors; Operating Temperature Range: -55℃~+155℃
U41 = MAX31865ATP+T: LCSC Part Name: MAX31865ATP; Supplier Part: C118474; Manufacturer: ADI(亚德诺); Supplier Footprint: QFN-20-EP(5x5); JLCPCB Part Class: Extended Part; Datasheet: https://atta.szlcsc.com/upload/public/pdf/source/20170713/C118474_1499918888820816758.pdf; Supplier: LCSC

## Nets
3V3: C13.1 C14.2 C16.1 C24.2 C41.2 C42.2 C61.2 J5.2 P1.1 R1.2 R12.1 R13.2 R61.2 R62.2 U11.2(3V3) U23.2(VOUT) U41.19(DVDD) U41.20(VDD) U61.8(VCC)
GND: C2.1 C3.1 C4.1 C5.2 C13.2 C14.1 C16.2 C22.2 C23.1 C24.1 C41.1 C42.1 C61.1 J5.4 P1.3 P28.1 R43.1 R44.2 SW1.3(C) SW1.4(D) SW2.3(C) SW2.4(D) U1.3(-VO) U11.1(GND) U11.40(GND) U11.41(GND) U23.1(ADJ) U32.8(E) U41.6(FORCE2) U41.10(GND2) U41.15(DGND) U41.16(GND1) U41.21(EP) U61.4(GND) USB1.15(EH) USB1.A1(GND) USB1.A12(GND) USB1.B1(GND) USB1.B12(GND)
VCC: C2.2 C3.2 C4.2 C5.1 C22.1 C23.2 D1.1(C) D2.1(C) D3.1(C) K1.4 K2.4 K3.4 P28.2 P31.1 P32.1 P33.1 U1.4(+VO) U23.3(VIN) U32.9(COM) USB1.A4(VBUS) USB1.A9(VBUS) USB1.B4(VBUS) USB1.B9(VBUS)
RLY1_OUT: D1.2(A) K1.1 U32.16(1C)
RLY2_OUT: D2.2(A) K2.1 U32.15(2C)
RLY3_OUT: D3.2(A) K3.1 U32.14(3C)
U11_EN: J5.1 R1.1 SW2.1(A) SW2.2(B) U11.3(EN)
U11_IO0: J5.6 R13.1 SW1.1(A) SW1.2(B) U11.27(IO0)
U11_IO4: P1.2 R12.2 U11.4(IO4)
U11_IO5: U11.5(IO5) U32.1(1B)
U11_IO6: U11.6(IO6) U32.2(2B)
U11_IO7: U11.7(IO7) U32.3(3B)
U11_IO8: R61.1 U11.12(IO8) U61.5(SDA)
U11_IO9: R62.1 U11.17(IO9) U61.6(SCL)
U11_IO15: U11.8(IO15) U32.4(4B)
U11_IO16: U11.9(IO16) U32.5(5B)
U11_IO17: U11.10(IO17) U32.6(6B)
U11_IO39: U11.32(IO39) U41.14(SDO)
U11_IO40: U11.33(IO40) U41.11(SDI)
U11_IO41: U11.34(IO41) U41.12(SCLK)
U11_IO42: U11.35(IO42) U41.13(#CS)
U11_UART0_RX: J5.5 U11.36(RXD0)
U11_UART0_TX: J5.3 U11.37(TXD0)
U27_USBD+: U11.14(IO20) USB1.A6(DP1) USB1.B6(DP2)
U27_USBD-: U11.13(IO19) USB1.A7(DN1) USB1.B7(DN2)
$1N51801: R43.2 USB1.B5(CC2)
$1N51840: R44.1 USB1.A5(CC1)
$2N2169: K2.5 P22.2
$2N2174: C1.1 L1.1 P21.1 P22.1 P23.1 P29.2 R9.1
$2N2175: K3.5 P23.2
$2N6925: C1.2 F21.1 L1.4 R9.2
$2N7118: L1.2 U1.2(AC)
$2N7268: F210.1 F220.1 P29.1
$2N13709: L1.3 U1.1(AC)
$2N17357: K1.5 P21.2
$2N17880: F22.1 K1.2 K2.2 K3.2 P21.3 P22.3 P23.3
$3N2828: P31.2 U32.13(4C)
$3N2832: P32.2 U32.12(5C)
$3N2837: P33.2 U32.11(6C)
$5N278: R41.1 U41.1(BIAS) U41.2(REFIN+)
$5N289: R42.1 U41.3(REFIN-) U41.4(ISENSOR)
$5N684: R41.2 R42.2
$5N942: C43.2 J41.2 U41.5(FORCE+) U41.7(RTDIN+)
$5N951: C43.1 J41.1 U41.8(RTDIN) U41.9(FORCE-)

Not connected (* = marked no-connect by the designer): U11 11(IO18)* 15(IO3)* 16(IO46)* 18(IO10)* 19(IO11)* 20(IO12)* 21(IO13)* 22(IO14)* 23(IO21)* 24(IO47)* 25(IO48)* 26(IO45)* 28(IO35)* 29(IO36)* 30(IO37)* 31(IO38)* 38(IO2)* 39(IO1)*; U32 7(7B)* 10(7C)*; U41 17(N.C)* 18(#DRDY)*; U61 1(NC)* 2(NC)* 3(NC)* 7(NC)*

## Notes on the sheets
sheet 1
- https://www.espressif.com/sites/default/files/documentation/esp32-s3-wroom-1_wroom-1u_datasheet_en.pdf
- Reset
- Download
sheet 2
- R9 has incorrect footprint
- PSU Schematic https://www.hlktech.com/en/Goods-16.html

# Board PCB
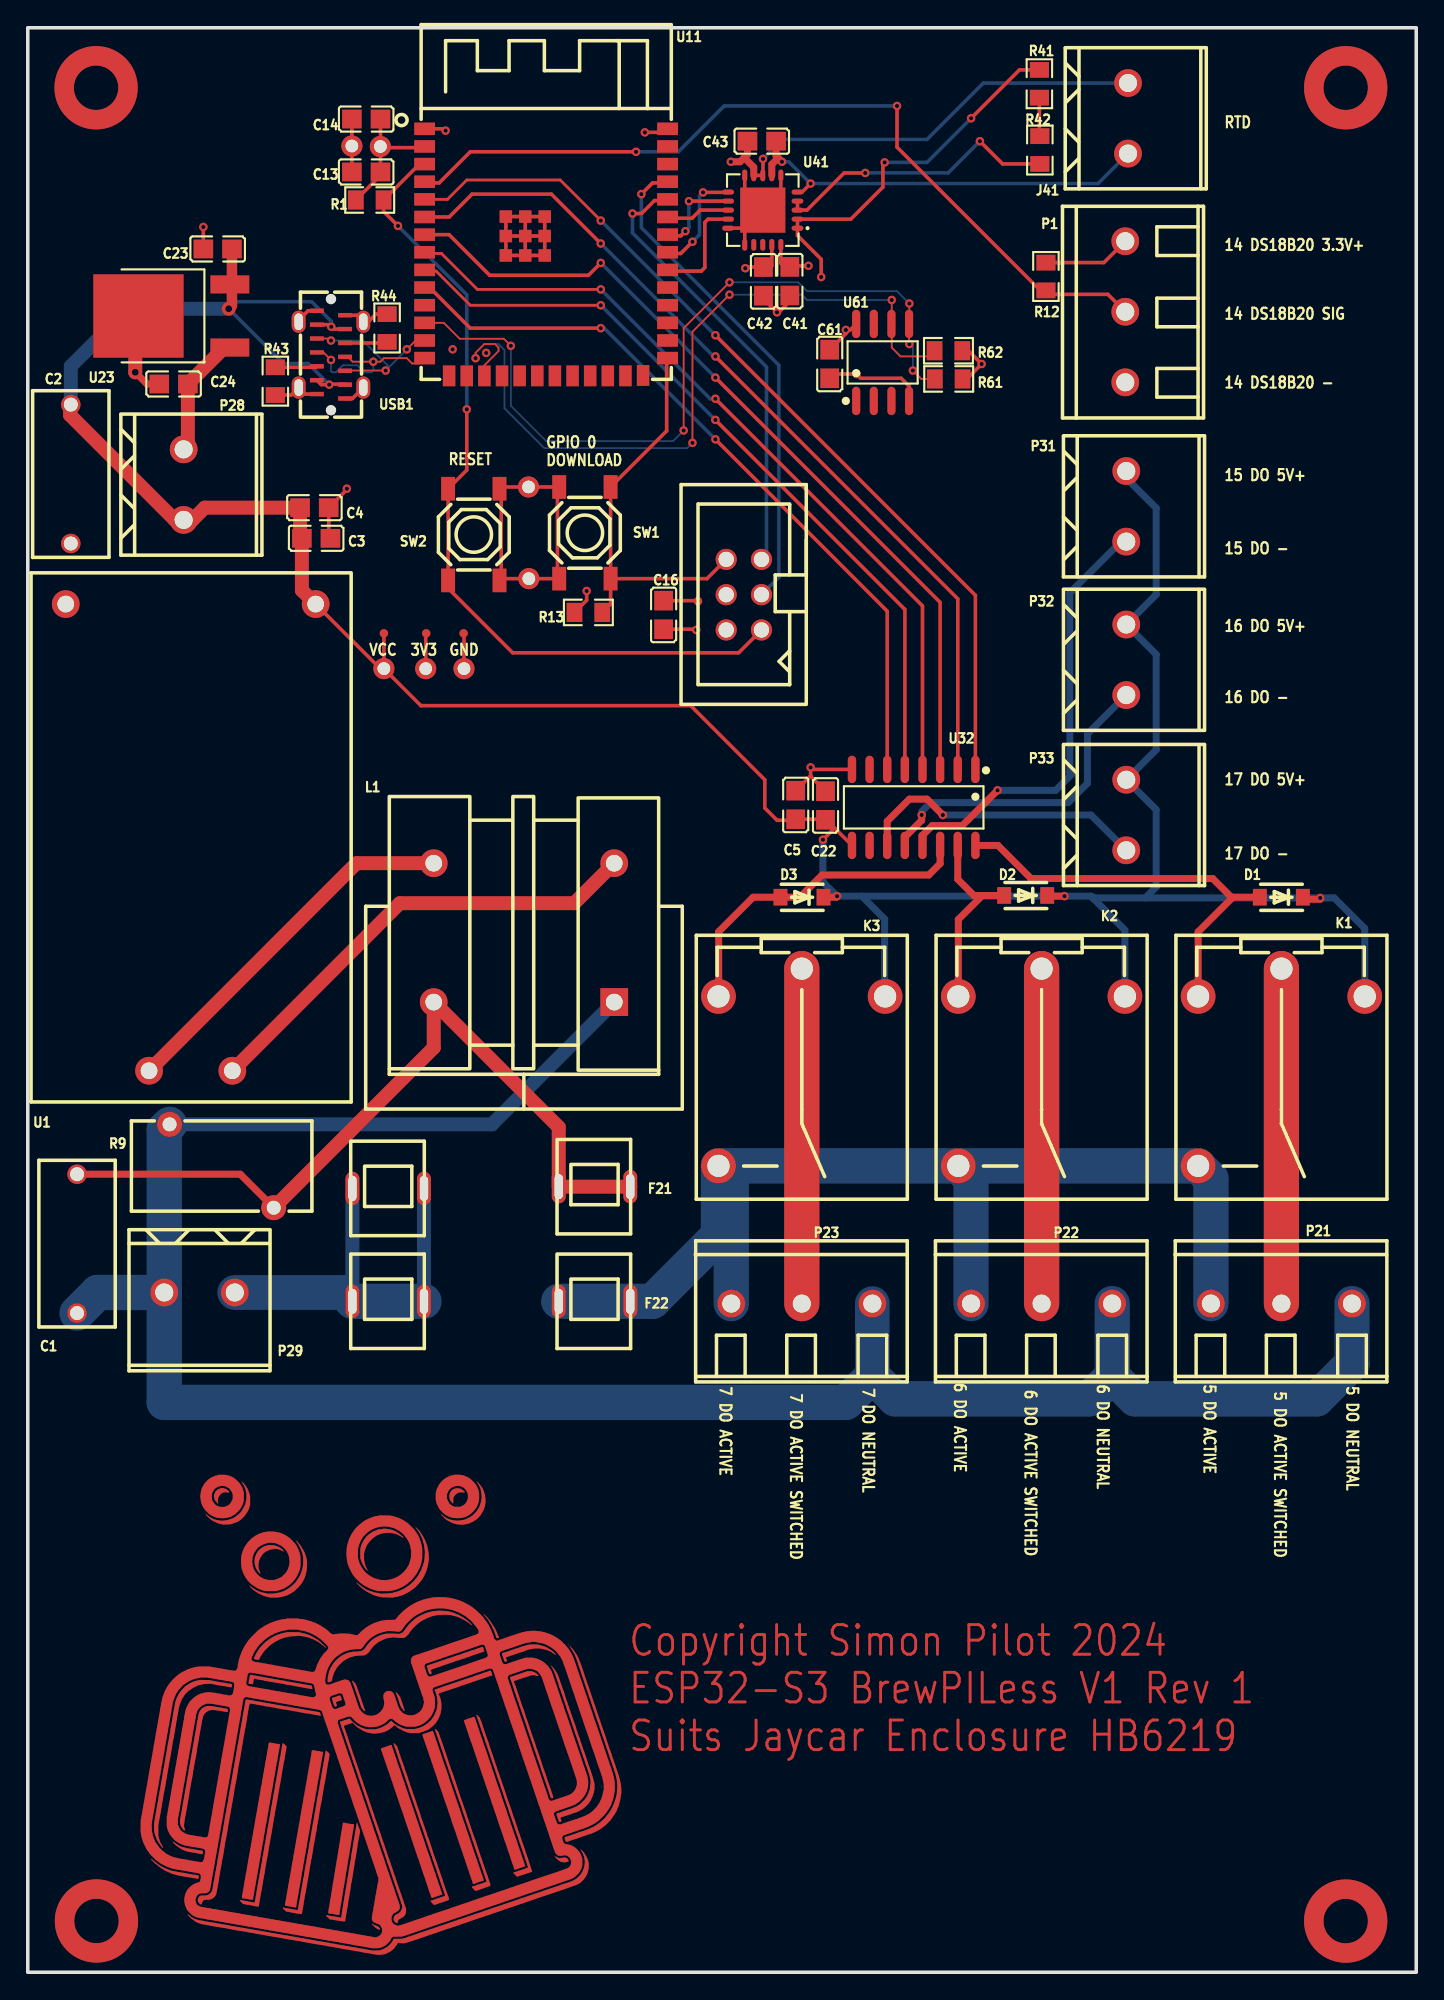
[diagram p5: board, top side]
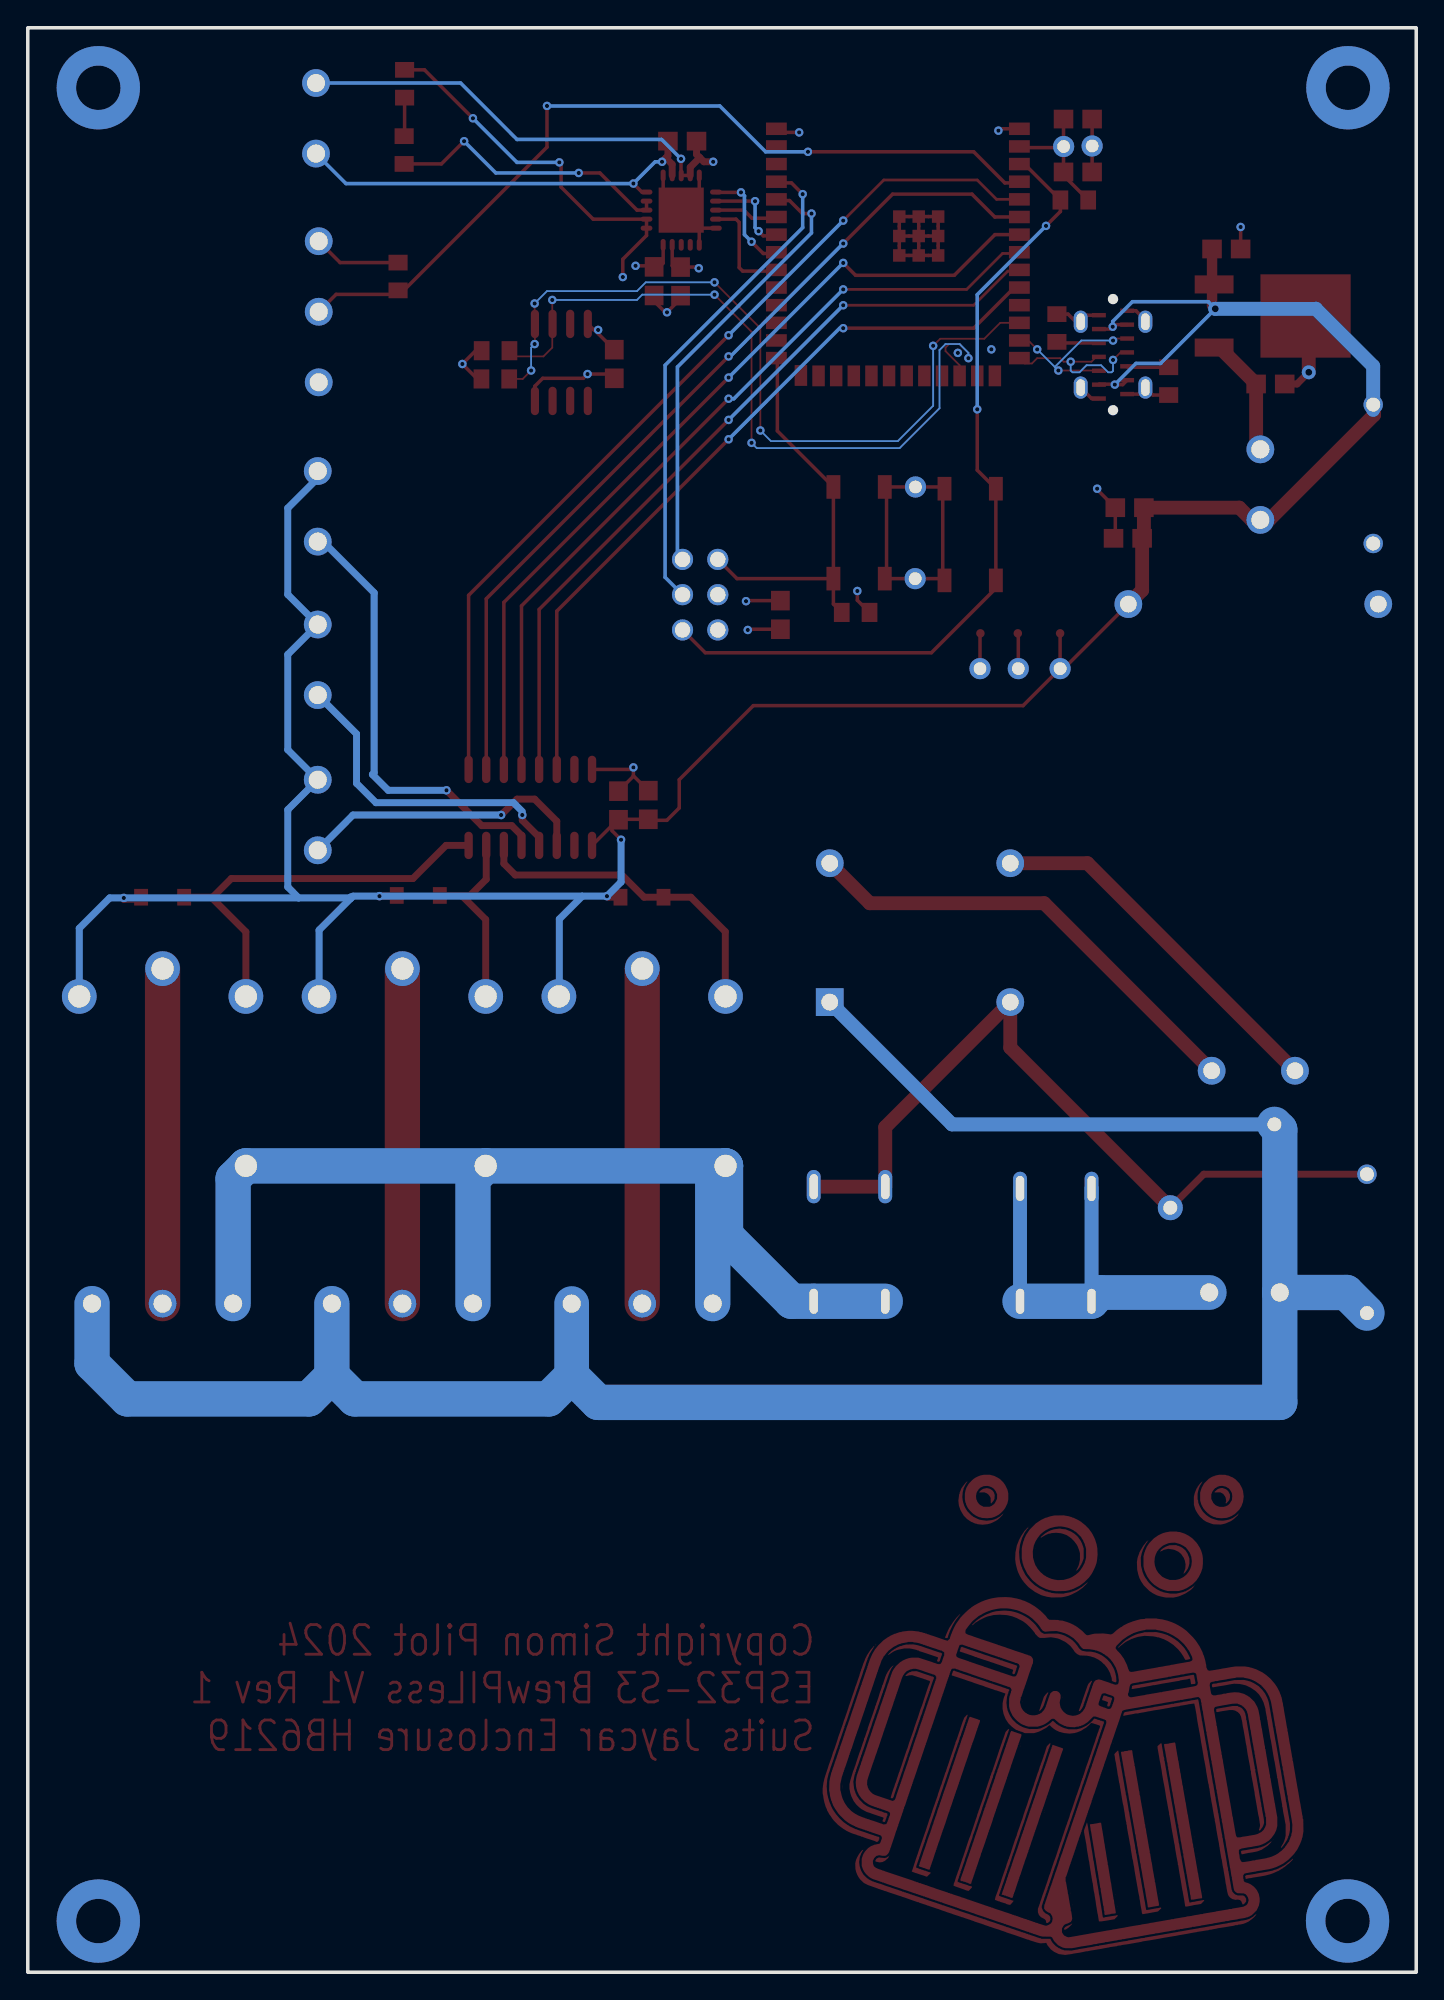
[diagram p6: board, bottom side, seen from below]

Outline 100 x 140 mm; copper layers: Top Layer, GND, 3V3, Bottom Layer. Coordinates in mm from the lower left corner of the outline.
Outline path: rectangle 100,140 0,0
Stack: Top Layer 0.035mm 外层铜厚1oz / Dielectric1 0.2104mm 7628 RC49% 8.6mil / GND 0.0152mm 内层铜厚 / Dielectric2 1.065mm 1.1mm H/HOZ 含铜 / 3V3 0.0152mm 内层铜厚 / Dielectric3 0.2104mm 7628 RC49% 8.6mil / Bottom Layer 0.035mm 外层铜厚1oz

## Design rules (mm)
net U27_USBD+: DP1
net U27_USBD-: DP1
net U11_IO39: U11_SPI
net U11_IO40: U11_SPI
net U11_IO8: U11_I2C
net U11_IO9: U11_I2C
template: User Custom Config
spacing safeClearance (default): track to track 0.152, other pairs 0.152 to 0.3
track width trackWidth (default): min 0.127, default 0.254, max 2.54
differential pair differentialPair (default): width min 0.127, default 0.254, max 2.54; gap min 0.152, default 0.152
via viaSize (default): diameter min 0.5, default 0.61, max 10; hole min 0.3, default 0.305, max 5.999
net VCC uses innerPlane1

## Placement (name value [footprint] x y rotation side)
C1  100nF  [CAP-TH_L12.0-W5.5-P10.00-D0.6]  3.55 52.46 90 top
C2  100nF  [CAP-TH_L12.0-W5.5-P10.00-D0.6]  3.1 107.87 90 top
C3  1uF  [C0805]  20.77 103.24 180 top
C4  10uF  [C0805]  20.64 105.45 180 top
C5  22uF  [C0805]  55.31 84.04 90 top
C13  100nF  [C0805]  24.37 129.62 180 top
C14  22uF  [C0805]  24.37 133.43 0 top
C16  100nF  [C0805]  45.79 97.73 90 top
C22  100nF  [C0805]  57.45 84.01 90 top
C23  10uF  [C0805]  13.68 124.07 0 top
C24  10uF  [C0805]  10.5 114.35 180 top
C41  100nF  [C0805]  54.89 121.76 90 top
C42  100nF  [C0805]  52.98 121.74 90 top
C43  100nF  [C0805]  52.86 131.84 0 top
C61  100nF  [C0805]  57.76 115.79 90 top
D1  SM4007PL  [SOD-123F_L2.8-W1.8-LS3.7-RD]  90.29 77.4 180 top
D2  SM4007PL  [SOD-123F_L2.8-W1.8-LS3.7-RD]  71.87 77.53 180 top
D3  SM4007PL  [SOD-123F_L2.8-W1.8-LS3.7-RD]  55.76 77.4 180 top
F21  -  [FUSE-TH_5X20RHOSFUSECLIP-SEAT]  40.82 56.56 0 top
F22  5A  [FUSE-TH_5X20RHOSFUSECLIP-SEAT]  40.82 48.31 0 top
F210  1A  [FUSE-TH_5X20RHOSFUSECLIP-SEAT]  25.96 56.43 0 top
F220  10A  [FUSE-TH_5X20RHOSFUSECLIP-SEAT]  25.96 48.31 0 top
J5  PROG  [IDC-TH_6P-P2.54_C11214]  51.57 99.18 90 top
J41  WJ500V-5.08-2P  [CONN-TH_2P-P5.00_WJ500V-5.08-2P]  79.24 133.48 270 top
K1  -  [RELAY-TH_973-XXVDC-SL-A]  90.29 65.16 270 top
K2  -  [RELAY-TH_973-XXVDC-SL-A]  73.02 65.16 270 top
K3  -  [RELAY-TH_973-XXVDC-SL-A]  55.75 65.16 270 top
L1  -  [FILTER-TH_UU10.5Y-10MH]  35.74 74.85 0 top
NOREF  -  [Pad_e4638]  28.66 93.86 0 top
NOREF#2  -  [Pad_e4640]  31.42 93.86 0 top
NOREF#3  -  [Pad_e4712]  28.7 96.4 0 top
NOREF#4  -  [Pad_e4711]  25.65 96.4 0 top
NOREF#5  -  [Pad_e1184]  36.09 100.34 0 top
NOREF#6  -  [Pad_e1180]  36.07 106.94 0 top
NOREF#7  -  [Pad_e4713]  31.39 96.4 0 top
NOREF#8  -  [Pad_e1266]  23.34 131.49 0 top
NOREF#9  -  [Pad_e1270]  25.39 131.45 0 top
NOREF#10  -  [Pad_e4629]  25.65 93.86 0 top
P1  WJ500V-5.08-3P  [CONN-TH_3P-P5.00_WJ500V-5.08-3P]  79.05 119.55 270 top
P21  WJ500V-5.08-3P  [CONN-TH_3P-P5.00_WJ500V-5.08-3P]  90.29 48.14 180 top
P22  WJ500V-5.08-3P  [CONN-TH_3P-P5.00_WJ500V-5.08-3P]  73.02 48.14 180 top
P23  WJ500V-5.08-3P  [CONN-TH_3P-P5.00_WJ500V-5.08-3P]  55.75 48.14 180 top
P28  WJ500V-5.08-2P  [CONN-TH_2P-P5.00_WJ500V-5.08-2P]  11.23 107.11 270 top
P29  WJ500V-5.08-2P  [CONN-TH_2P-P5.00_WJ500V-5.08-2P]  12.37 48.94 180 top
P31  WJ500V-5.08-2P  [CONN-TH_2P-P5.00_WJ500V-5.08-2P]  79.11 105.54 270 top
P32  WJ500V-5.08-2P  [CONN-TH_2P-P5.00_WJ500V-5.08-2P]  79.11 94.49 270 top
P33  WJ500V-5.08-2P  [CONN-TH_2P-P5.00_WJ500V-5.08-2P]  79.11 83.32 270 top
R1  12kΩ  [R0805]  24.63 127.6 180 top
R9  10D561K  [RES-TH_L13.0-W6.0-P7.50-D0.9-S6.00]  13.96 58.05 0 top
R12  4.7kΩ  [R0805]  73.33 122.09 270 top
R13  12kΩ  [R0805]  40.37 97.91 180 top
R41  200Ω  [R0805]  72.86 135.97 270 top
R42  200Ω  [R0805]  72.89 131.2 90 top
R43  56kΩ  [R0805]  17.83 114.56 90 top
R44  56kΩ  [R0805]  25.88 118.38 90 top
R61  2.4kΩ  [R0805]  66.33 114.72 0 top
R62  2.4kΩ  [R0805]  66.31 116.75 0 top
SW1  TS-1187A-B-A-B  [SW-SMD_4P-L5.1-W5.1-P3.70-LS6.5-TL-2]  40.13 103.64 270 top
SW2  TS-1187A-B-A-B  [SW-SMD_4P-L5.1-W5.1-P3.70-LS6.5-TL-2]  32.12 103.51 90 top
U1  -  [PWRM-TH_HLK-5M05]  11.73 81.71 90 top
U11  2.4GHz  [WIRELM-SMD_ESP32-S3-WROOM-1]  37.33 123.83 0 top
U23  -  [TO-252-2_L6.6-W6.1-P4.57-LS9.9-TL-CW]  11.26 119.25 180 top
U32  -  [SOIC-16_L9.9-W3.9-P1.27-LS6.0-BL]  63.8 83.87 180 top
U41  MAX31865ATP+T  [QFN-20_L5.0-W5.0-P0.65-BL-EP]  52.94 126.87 90 top
U61  ATECC608A-SSHDA-T  [SOIC-8_L4.9-W3.9-P1.27-LS6.0-BL]  61.57 115.9 0 top
USB1  TYPE-C 14P LTH10.0  [TYPE-C-SMD_918-468K2029Y50001]  21.84 116.47 0 top

## Footprints (pads in the part's own frame, mm; a bottom-side part is the same pattern mirrored in y, then rotated)
C0805
  rect 1.41x1.35 smd: 1(-1.03,0) 2(1.03,0)
CAP-TH_L12.0-W5.5-P10.00-D0.6
  round 1.4 hole 1: 1(-5,0) 2(5,0)
CONN-TH_2P-P5.00_WJ500V-5.08-2P
  round 2 hole 1.3: 1(-2.54,0) 2(2.54,0)
CONN-TH_3P-P5.00_WJ500V-5.08-3P
  round 2 hole 1.3: 1(-5.08,0) 2(0,0) 3(5.08,0)
FILTER-TH_UU10.5Y-10MH
  rect 2x2 hole 1.2: 1(6.5,-5)
  round 2 hole 1.2: 2(6.5,5) 3(-6.5,5) 4(-6.5,-5)
FUSE-TH_5X20RHOSFUSECLIP-SEAT
  oval 1x2.4 hole 0.6x1.8: 1(-2.575,0)
  oval 1x2.4 hole 0.6x1.799: 1(2.575,0)
IDC-TH_6P-P2.54_C11214
  round 1.524 hole 1.1: 1(-2.54,-1.27) 2(-2.54,1.27) 3(0,-1.27) 4(0,1.27) 5(2.54,-1.27) 6(2.54,1.27)
Pad_e1180
  round 1.524 hole 0.914: 42(0,0)
Pad_e1184
  round 1.524 hole 0.914: 43(0,0)
Pad_e1266
  round 1.524 hole 0.914: 44(0,0)
Pad_e1270
  round 1.524 hole 0.914: 45(0,0)
Pad_e4629
  round 1.524 hole 0.914: 1(0,0)
Pad_e4638
  round 1.524 hole 0.914: 1(0,0)
Pad_e4640
  round 1.524 hole 0.914: 1(0,0)
Pad_e4711
  round 0.61 smd: TP1(0,0)
Pad_e4712
  round 0.61 smd: TP2(0,0)
Pad_e4713
  round 0.61 smd: TP3(0,0)
PWRM-TH_HLK-5M05
  round 2 hole 1.2: 1(-16.8,3) 2(-16.8,-3) 3(16.8,9) 4(16.8,-9)
QFN-20_L5.0-W5.0-P0.65-BL-EP
  oval 0.364x0.847 smd: 1(-1.3,-2.498) 2(-0.65,-2.498) 3(0,-2.498) 4(0.65,-2.498) 5(1.3,-2.498) 11(1.3,2.498) 12(0.65,2.498) 13(0,2.498) 14(-0.65,2.498) 15(-1.3,2.498)
  oval 0.847x0.364 smd: 6(2.498,-1.3) 7(2.498,-0.65) 8(2.498,0) 9(2.498,0.65) 10(2.498,1.3) 16(-2.498,1.3) 17(-2.498,0.65) 18(-2.498,0) 19(-2.498,-0.65) 20(-2.498,-1.3)
  rect 3.25x3.25 smd: 21(0,0)
R0805
  rect 1.133x1.377 smd: 1(-1,0) 2(1,0)
RELAY-TH_973-XXVDC-SL-A
  round 2.5 hole 1.6: 1(-5.1,-6) 2(7.1,-6) 4(-5.1,6) 5(-7.1,0)
RES-TH_L13.0-W6.0-P7.50-D0.9-S6.00
  round 1.8 hole 1: 1(-3.75,3) 2(3.75,-3)
SOD-123F_L2.8-W1.8-LS3.7-RD
  rect 1x1.2 smd: 1(-1.55,0) 2(1.55,0)
SOIC-8_L4.9-W3.9-P1.27-LS6.0-BL
  oval 0.588x2.045 smd: 1(-1.905,-2.772) 2(-0.635,-2.772) 3(0.635,-2.772) 4(1.905,-2.772) 5(1.905,2.772) 6(0.635,2.772) 7(-0.635,2.772) 8(-1.905,2.772)
SOIC-16_L9.9-W3.9-P1.27-LS6.0-BL
  oval 0.602x1.971 smd: 1(-4.445,-2.736) 2(-3.175,-2.736) 3(-1.905,-2.736) 4(-0.635,-2.736) 5(0.635,-2.736) 6(1.905,-2.736) 7(3.175,-2.736) 8(4.445,-2.736) 9(4.445,2.736) 10(3.175,2.736) 11(1.905,2.736) 12(0.635,2.736) 13(-0.635,2.736) 14(-1.905,2.736) 15(-3.175,2.736) 16(-4.445,2.736)
SW-SMD_4P-L5.1-W5.1-P3.70-LS6.5-TL-2
  rect 1.7x1 smd: 1(-3.3,1.85) 2(3.3,1.85) 3(-3.3,-1.85) 4(3.3,-1.85)
TO-252-2_L6.6-W6.1-P4.57-LS9.9-TL-CW
  rect 2.8x1.3 smd: 1(-3.292,2.273) 3(-3.292,-2.273)
  rect 6.5x6 smd: 2(3.292,0)
TYPE-C-SMD_918-468K2029Y50001
  oval 1x1.6 hole 0.6x1.2: 15(-2.33,2.37) 15(-2.33,-2.37) 15(2.33,2.37) 15(2.33,-2.37)
  rect 1x0.32 smd: A1(1.016,2.84) A4(1.016,1.84) A5(1.016,0.84) A6(1.016,-0.16) A7(1.016,-1.16) A9(1.016,-2.16) A12(1.016,-3.16) B1(-1.016,-2.84) B4(-1.016,-1.84) B5(-1.016,-0.84) B6(-1.016,0.16) B7(-1.016,1.16) B9(-1.016,2.16) B12(-1.016,3.16)
WIRELM-SMD_ESP32-S3-WROOM-1
  rect 1.5x0.9 smd: 1(-8.75,8.895) 2(-8.75,7.625) 3(-8.75,6.355) 4(-8.75,5.085) 5(-8.75,3.815) 6(-8.75,2.545) 7(-8.75,1.275) 8(-8.75,0.005) 9(-8.75,-1.265) 10(-8.75,-2.535) 11(-8.75,-3.805) 12(-8.75,-5.075) 13(-8.75,-6.345) 14(-8.75,-7.615) 27(8.75,-7.615) 28(8.75,-6.345) 29(8.75,-5.075) 30(8.75,-3.805) 31(8.75,-2.535) 32(8.75,-1.265) 33(8.75,0.005) 34(8.75,1.275) 35(8.75,2.545) 36(8.75,3.815) 37(8.75,5.085) 38(8.75,6.355) 39(8.75,7.625) 40(8.75,8.895)
  rect 0.9x1.5 smd: 15(-6.985,-8.895) 16(-5.715,-8.895) 17(-4.445,-8.895) 18(-3.175,-8.895) 19(-1.905,-8.895) 20(-0.635,-8.895) 21(0.635,-8.895) 22(1.905,-8.895) 23(3.175,-8.895) 24(4.445,-8.895) 25(5.715,-8.895) 26(6.985,-8.865)
  rect 0.9x0.9 smd: 41(-2.9,2.575) 41(-2.9,1.175) 41(-2.9,-0.225) 41(-1.5,2.575) 41(-1.5,1.175) 41(-1.5,-0.225) 41(-0.1,2.575) 41(-0.1,1.175) 41(-0.1,-0.225)

## Nets
As in the schematic, except:
3V3: C13.1 C14.2 C16.1 C24.2 C41.2 C42.2 C61.2 J5.2 NOREF.1 NOREF#3.TP2 NOREF#9.45 P1.1 R1.2 R12.1 R13.2 R61.2 R62.2 U11.2 U23.2 U41.19 U41.20 U61.8
GND: C2.1 C3.1 C4.1 C5.2 C13.2 C14.1 C16.2 C22.2 C23.1 C24.1 C41.1 C42.1 C61.1 J5.4 NOREF#2.1 NOREF#5.43 NOREF#6.42 NOREF#7.TP3 NOREF#8.44 P1.3 P28.1 R43.1 R44.2 SW1.3 SW1.4 SW2.3 SW2.4 U1.3 U11.1 U11.40 U11.41 U23.1 U32.8 U41.6 U41.10 U41.15 U41.16 U41.21 U61.4 USB1.15 USB1.A1 USB1.A12 USB1.B1 USB1.B12
VCC: C2.2 C3.2 C4.2 C5.1 C22.1 C23.2 D1.1 D2.1 D3.1 K1.4 K2.4 K3.4 NOREF#4.TP1 NOREF#10.1 P28.2 P31.1 P32.1 P33.1 U1.4 U23.3 U32.9 USB1.A4 USB1.A9 USB1.B4 USB1.B9

Pads without a net: U11 11 15 16 18 19 20 21 22 23 24 25 26 28 29 30 31 38 39; U32 7 10; U41 17 18; U61 1 2 3 7

## Via types
v1: diameter 6, hole 3.2, Top Layer to Bottom Layer, 4 vias
v2: diameter 0.61, hole 0.305, Top Layer to Bottom Layer, 72 vias
v3: diameter 1, hole 0.5, Top Layer to Bottom Layer, 2 vias

## Routing (per net, layer and track width the routed paths; a pad name or vN(x,y) marks a point on that pad's centre or on a via; arc(x,y) is an arc through that point)
3V3: length 42.9
  Top Layer w0.254: 25.48,131.37 25.4,131.44 C14.2 ; 25.48,131.37 25.4,131.37 C13.1 25.4,129.38 R1.2 ; 25.48,131.37 28.51,131.37 ; P1.1 77.51,123.09 R12.1 ; 67.31,114.72 67.62,114.72 v2(68.7,115.79) 67.75,116.75 67.33,116.75 ; R13.2 40.25,98.78 v2(40.25,99.45) ; U41.19 53.59,122.87 52.98,122.26 ; NOREF#3.TP2 28.66,96.36 NOREF.1 ; v2(48.14,96.64) 48.09,96.7 45.92,96.7 ; C42.2 51.76,122.77 v2(51.68,122.69) ; C61.2 58.92,117.99 v2(58.92,118.24) 59.23,118.24 U61.8 ; U41.20 54.24,123.05 55.01,122.28 ; v2(56.23,122.86) 54.96,122.86 54.89,122.79
  Top Layer w0.5: v3(7.74,115.2) 8.58,114.35 C24.2
  Top Layer w1: U23.2 7.74,119.02 v3(7.74,115.2)
GND: length 99.3
  Top Layer w0.254: U11.41 U11.41 U11.41 ; U11.41 U11.41 U11.41 ; U11.41 U11.41 ; U11.41 U11.41 ; U11.41 U11.41 U11.41 ; 20.82,119.63 20.19,119.63 19.51,118.95 19.51,118.84 ; U11.41 U11.41 ; U11.41 U11.41 ; 20.82,113.63 19.98,113.63 USB1.15 18.97,113.56 R43.1 ; U11.41 U11.41 U11.41 ; v2(44.44,132.47) 45.84,132.47 46.01,132.64 ; 52.11,127.86 52.1,127.86 51.64,128.32 51.64,129.37 ; C14.1 NOREF#8.44 C13.2 ; C23.1 v2(12.65,125.66) 12.57,125.74 ; 51.64,125.57 52.44,126.37 U41.21 ; 51.64,125.57 U41.16 ; 51.64,125.57 50.44,125.57 ; 56.38,86.15 v2(56.38,86.75) 56.53,86.6 U32.8 ; 56.38,86.15 56.38,86.11 C22.2 ; 56.38,86.15 C5.2 ; 52.98,120.2 53.27,120.2 v2(53.96,119.51) 54.09,119.51 54.79,120.22 55.01,120.22 ; v2(22.98,106.81) 22.98,106.75 21.67,105.45 21.67,103.37 C3.1 ; USB1.A1 23.7,119.31 24.17,118.84 24.53,118.84 25.08,119.38 25.63,119.38 ; v2(48.27,98.71) 48.23,98.76 45.92,98.76 ; USB1.A12 23.38,113.31 USB1.15 ; v2(30.09,132.59) 29.96,132.73 U11.1 ; C61.1 58.06,115.07 v2(59.68,115.07) 59.99,114.76 62.91,114.76 63.47,114.2 U61.4 ; NOREF#7.TP3 31.42,96.37 NOREF#2.1 ; 53.74,127.87 54.24,128.37 54.24,129.37 ; 38.02,106.94 38.15,106.81 38.15,100.21 38.02,100.34 NOREF#5.43 34.1,100.34 34.1,106.94 NOREF#6.42 38.02,106.94
  Top Layer w1: 14.55,116.98 14.15,116.98 C24.1 11.53,109.65 P28.1
  vias: v1(4.92,135.68) v1(94.92,135.68) v2(30.6,116.85) v2(33.01,116.59) v2(94.92,135.68)
VCC: length 225.7
  Top Layer w0.254: 19.74,102.81 C3.2 ; 55.31,83.3 C5.1 ; C5.1 55.23,82.94 53.97,82.94 53.08,83.83 53.08,85.86 47.75,91.19 28.31,91.19 NOREF#10.1 ; C5.1 57.42,83.01 C22.1 57.51,82.98 57.92,82.57 ; 57.92,82.57 U32.9 ; 57.92,82.57 57.92,82.19 v2(57.27,81.54) ; NOREF#10.1 NOREF#4.TP1 ; NOREF#10.1 25.38,93.86 U1.4 ; 20.82,118.63 21.71,118.63 22.03,118.31 USB1.A4 ; USB1.A9 22.82,114.34 21.75,114.34 v2(21.71,114.31) 21.14,114.31 20.82,114.63
  Top Layer w0.5: D2.1 73.47,77.48 v2(74.67,77.48) ; v2(58.29,77.48) 58.21,77.4 D3.1 ; v2(93.08,77.35) 93.08,77.25 91.99,77.25 D1.1
  Top Layer w0.75: v3(14.47,119.77) 14.71,120 C23.2
  Top Layer w1: 3.1,112.49 3.04,112.43 3.04,112.12 10.59,104.57 11.86,104.57 12.74,105.45 C4.2 19.61,103.37 C3.2 ; 19.74,102.81 19.74,99.5 U1.4
  Bottom Layer w0.254: v2(21.71,114.31) 20.19,115.83 18.41,115.83 v3(14.47,119.77) 14.98,120.28 20.44,120.28 21.86,118.85 v2(21.86,118.47)
  Bottom Layer w0.5: K3.4 61.72,70.29 61.72,75.83 60.07,77.48 ; 60.07,77.48 v2(58.29,77.48) 57.27,78.49 v2(57.27,81.54) ; 60.07,77.48 v2(74.67,77.48) 76.58,77.48 76.77,77.41 ; 80.48,77.35 v2(93.08,77.35) 94.1,77.35 96.29,75.16 K1.4 ; 80.48,77.35 81.27,78.14 81.27,83.7 P33.1 81.27,88.02 81.27,94.88 P32.1 81.27,99.19 81.27,105.42 79.11,107.58 P31.1 ; 80.48,77.35 76.7,77.35 79.02,75.03 K2.4
  Bottom Layer w1: 3.1,112.49 3.1,115.63 7.23,119.77 v3(14.47,119.77)
(no net):
  vias: v1(4.95,3.69) v1(94.92,3.68)
RLY1_OUT: length 30.2
  Top Layer w0.5: 86.73,77.35 85.34,78.75 72.26,78.75 69.87,81.13 U32.16 ; 86.73,77.35 86.79,77.4 D1.2 ; 86.73,77.35 84.29,74.91 K1.1
RLY2_OUT: length 14.3
  Top Layer w0.5: 68.75,77.53 68.14,77.53 66.98,78.69 U32.15 ; 68.75,77.53 67.02,75.79 K2.1 ; 68.75,77.53 D2.2
RLY3_OUT: length 24.3
  Top Layer w0.5: 49.76,69.93 49.76,74.92 52.24,77.4 D3.2 55.61,77.4 57.21,79 64.89,79 65.71,79.82 U32.14
U11_EN: length 60.1
  Top Layer w0.254: v2(31.62,112.53) 31.62,108.15 SW2.2 SW2.1 30.28,99.65 34.92,95 51.2,95 J5.1 ; 28.51,130.1 28.12,130.1 R1.1 25.63,126.77 v2(26.66,125.74)
  Bottom Layer w0.254: v2(26.66,125.74) 31.62,120.78 v2(31.62,112.53)
U11_IO0: length 29
  Top Layer w0.254: R13.1 41.98,98.51 SW1.2 ; SW1.2 48.92,100.34 J5.6 ; SW1.2 SW1.1 46.01,110.97 46.01,116.13
U11_IO4: length 60.7
  Top Layer w0.254: P1.2 77.79,120.81 73.2,120.81 62.61,131.41 v2(62.61,134.37) ; 28.51,128.83 29.63,128.83 31.87,131.07 v2(43.81,131.07)
  Bottom Layer w0.254: v2(62.61,134.37) 50.16,134.37 46.86,131.07 v2(43.81,131.07)
U11_IO5: length 65.2
  Top Layer w0.2: v2(41.27,126.12) 38.35,129.04 31.62,129.04 30.22,127.65 U11.5
  Top Layer w0.254: U32.1 68.25,99.14 v2(49.52,117.86)
  Bottom Layer w0.254: v2(49.52,117.86) v2(41.27,126.12)
U11_IO6: length 63.4
  Top Layer w0.254: U11.6 30.35,126.38 32,128.02 37.71,128.02 v2(41.27,124.47) ; v2(49.52,116.34) 66.98,98.88 U32.2
  Bottom Layer w0.254: v2(41.27,124.47) 49.4,116.34 v2(49.52,116.34)
U11_IO7: length 60.9
  Top Layer w0.254: U11.7 30.34,125.11 33.27,122.18 40.38,122.18 v2(41.27,123.07) ; U32.3 65.71,98.63 v2(49.52,114.81)
  Bottom Layer w0.254: v2(41.27,123.07) v2(49.52,114.81)
U11_IO8: length 57.4
  Top Layer w0.127: v2(63.75,115.32) 64.35,114.72 R61.1 ; v2(47.24,111) 47.24,118.37 v2(50.54,121.67) ; v2(63.49,120.15) 63.49,118.7 U61.5 63.47,117.25 v2(63.49,117.23) ; v2(34.79,117.1) 34.28,117.61 31.11,117.61 29.96,118.76 U11.12
  Bottom Layer w0.127: v2(63.49,120.15) 62.61,121.04 56.13,121.04 55.49,121.67 v2(50.54,121.67) ; v2(63.49,117.23) 63.75,116.97 v2(63.75,115.32) ; v2(47.24,111) 46.47,110.24 37.34,110.24 34.79,112.78 v2(34.79,117.1)
U11_IO9: length 57.4
  Top Layer w0.127: v2(47.87,110.12) 47.87,118.12 v2(50.54,120.78) ; v2(32.25,116.21) 32.25,116.59 32.89,117.23 33.65,117.23 33.9,116.97 33.9,116.72 32.89,115.7 U11.17 ; R62.1 64.9,116.34 62.86,116.34 62.22,116.97 62.22,118.66 U61.6 62.22,118.7 v2(62.22,120.4)
  Bottom Layer w0.127: v2(50.54,120.78) 55.75,120.78 56.13,120.4 v2(62.22,120.4) ; v2(32.25,116.21) 32.25,116.59 32.89,117.23 33.9,117.23 34.33,116.8 34.33,112.61 37.2,109.73 47.49,109.73 v2(47.87,110.12)
U11_IO15: length 58.2
  Top Layer w0.2: 28.51,123.75 29.79,123.75 32.38,121.16 v2(41.27,121.16)
  Top Layer w0.254: v2(49.52,113.29) 64.44,98.37 U32.4
  Bottom Layer w0.254: v2(41.27,121.16) 49.14,113.29 v2(49.52,113.29)
U11_IO16: length 56.3
  Top Layer w0.2: 28.51,122.48 29.41,122.48 31.87,120.02 v2(41.27,120.02)
  Top Layer w0.254: U32.5 63.17,98.12 v2(49.52,111.77)
  Bottom Layer w0.254: v2(41.27,120.02) v2(49.52,111.77)
U11_IO17: length 54.4
  Top Layer w0.254: 28.51,121.21 29.03,121.21 31.87,118.37 v2(41.27,118.37) ; v2(49.52,110.37) 61.9,97.99 U32.6
  Bottom Layer w0.254: v2(49.52,110.37) 41.52,118.37 v2(41.27,118.37)
U11_IO39: length 7.9
  Top Layer w0.254: 46.01,122.48 48.51,122.48 48.76,122.73 48.76,125.99 48.99,126.22 U41.14
U11_IO40: length 7.9
  Top Layer w0.254: U41.11 50.42,128.15 v2(48.64,128.15) ; v2(47.87,124.59) 47.03,123.75 46.01,123.75
  Bottom Layer w0.254: v2(47.87,124.59) 48.38,125.1 48.38,127.9 v2(48.64,128.15)
U11_IO41: length 6.6
  Top Layer w0.254: 46.01,125.02 47.03,125.02 v2(47.36,125.36) ; v2(47.62,127.51) 47.63,127.52 U41.12
  Bottom Layer w0.254: v2(47.36,125.36) 47.62,125.61 v2(47.62,127.51)
U11_IO42: length 4.7
  Top Layer w0.254: U41.13 48.42,126.87 47.84,126.29 46.01,126.29
U11_UART0_RX: length 31.9
  Top Layer w0.254: 46.01,127.56 45.14,127.56 44.2,126.63 v2(43.55,126.63)
  Bottom Layer w0.254: v2(43.55,126.63) 43.55,125.23 53.21,115.58 53.21,102.09 J5.5
U11_UART0_TX: length 35.6
  Top Layer w0.254: v2(44.19,128.02) 45,128.83 46.01,128.83
  Bottom Layer w0.254: J5.3 54.1,100.44 54.1,115.7 44.19,125.61 v2(44.19,128.02)
U27_USBD+: length 12.6
  Top Layer w0.127: U11.14 28.2,115.83 27.68,115.83 27.3,116.21 25.65,116.21 25.39,115.96 v2(24.89,115.96) 23.39,115.96 22.98,116.37 22.92,116.37 USB1.A6 ; 20.82,116.63 20.83,116.63 21.29,116.63 v2(21.84,116.08)
  Bottom Layer w0.127: v2(21.84,116.08) 21.84,115.29 21.94,115.2 22.19,115.2 22.7,115.7 23.74,115.7 24.25,115.2 24.76,115.2 24.89,115.32 v2(24.89,115.96)
U27_USBD-: length 12.6
  Top Layer w0.127: 20.82,117.63 21.69,117.63 v2(21.84,117.48) ; v2(27.3,116.85) 27.85,117.4 28.51,117.4 ; USB1.A7 23.21,115.31 23.23,115.32 v2(25.78,115.32)
  Bottom Layer w0.127: 26.03,115.58 v2(27.3,116.85) ; 26.03,115.58 24.12,117.48 v2(21.84,117.48) ; 26.03,115.58 v2(25.78,115.32)
$1N51801: length 3
  Top Layer w0.254: R43.2 20.75,115.56 20.82,115.63
$1N51840: length 2.8
  Top Layer w0.254: 25.63,117.38 25.55,117.31 USB1.A5
$2N2169: length 24.1
  Top Layer w2.54: P22.2 K2.5
$2N2174: length 166.9
  Bottom Layer w1: R9.1 33.43,61.05 L1.1
  Bottom Layer w2.5: 60.83,42.93 P23.1
  Bottom Layer w2.54: 78.1,42.93 79.75,41.28 92.83,41.28 95.37,43.82 P21.1 ; 78.1,42.93 P22.1 ; 78.1,42.93 76.45,41.28 62.48,41.28 60.83,42.93 58.92,41.03 9.83,41.03 P29.2 ; P29.2 9.83,60.66 R9.1 ; P29.2 5.03,48.94 C1.1
$2N2175: length 24.1
  Top Layer w2.54: K3.5 P23.2
$2N6925: length 56.9
  Top Layer w0.5: C1.2 15.3,57.46 R9.2
  Top Layer w1: F21.1 F21.1 38.24,60.84 29.24,69.85 29.24,66.57 R9.2
$2N7118: length 33.7
  Top Layer w1: U1.2 26.8,76.97 39.36,76.97 L1.2
$2N7268: length 30.1
  Bottom Layer w1: F220.1 F210.1 ; F220.1 F210.1
  Bottom Layer w2.5: F220.1 22.75,48.94 P29.1
  Bottom Layer w2.54: F220.1 F220.1
$2N13709: length 26.7
  Top Layer w1: U1.1 23.68,79.85 29.24,79.85
$2N17357: length 24.1
  Top Layer w2.54: K1.5 P21.2
$2N17880: length 83.9
  Bottom Layer w2.54: F22.1 F22.1 44.99,48.31 49.75,53.06 K3.2 ; K2.2 K1.2 85.21,57.14 P21.3 ; K2.2 K3.2 ; K2.2 67.94,57.14 P22.3 ; K3.2 50.67,57.14 P23.3
$3N2828: length 32
  Top Layer w0.5: v2(69.84,85.1) 67.3,82.56 65.14,82.56 64.44,81.85 U32.13
  Bottom Layer w0.5: v2(69.84,85.1) 74.04,85.1 75.18,86.24 75.05,86.37 75.05,99.32 78.73,103 79.11,103
$3N2832: length 23
  Top Layer w0.5: v2(64.38,83.32) 64.38,82.94 63.17,81.72 U32.12
  Bottom Layer w0.5: P32.2 76.32,89.16 76.32,85.6 74.92,84.21 65.02,84.21 64.38,83.57
$3N2837: length 21.1
  Top Layer w0.5: v2(65.91,83.32) 64.76,84.46 63.49,84.46 61.9,82.87 U32.11
  Bottom Layer w0.5: P33.2 76.58,83.32 v2(65.91,83.32)
$5N278: length 27.7
  Top Layer w0.254: v2(61.72,130.31) 61.59,130.18 61.59,128.53 59.28,126.22 U41.2 55.44,125.04 57.14,123.34 v2(57.14,122.05) ; R41.1 71.43,136.97 v2(67.94,133.48)
  Bottom Layer w0.254: v2(67.94,133.48) 64.76,130.31 v2(61.72,130.31)
$5N289: length 20.8
  Top Layer w0.254: v2(68.57,131.83) 70.21,130.2 R42.1 ; v2(60.32,129.55) 58.8,129.55 56.12,126.87 U41.3 U41.4
  Bottom Layer w0.25: v2(60.32,129.55) 66.29,129.55 v2(68.57,131.83)
$5N684: length 2.8
  Top Layer w0.254: R42.2 72.86,132.23 R41.2
$5N942: length 30.8
  Top Layer w0.254: v2(56.38,128.78) 55.77,128.17 U41.5
  Top Layer w0.5: 54.04,130.63 53.89,130.78 C43.2 ; 54.04,130.63 53.59,130.17 53.59,129.37 ; 54.04,130.63 v2(54.32,130.35)
  Bottom Layer w0.254: J41.2 77.08,128.78 v2(56.38,128.78) 54.81,130.35 v2(54.32,130.35)
$5N951: length 34.3
  Top Layer w0.254: 52.29,129.37 52.94,129.37 52.95,129.39 v2(52.95,130.56)
  Top Layer w0.5: 52.29,129.37 52.29,129.96 51.6,130.65 ; C43.1 51.83,130.88 51.6,130.65 ; v2(50.64,130.35) 51.3,130.35 51.6,130.65
  Bottom Layer w0.254: v2(52.95,130.56) 54.35,131.96 64.76,131.96 68.83,136.02 J41.1

## Copper pours and planes (outline as drawn; the poured copper is in the pictures)
3V3 on 3V3: 0.26,139.74 99.74,139.74 99.74,83.98 0.26,83.98
GND on Top Layer: 0.11,89.18 48.36,89.18 49.78,87.76 49.78,83.84 99.99,83.84 99.82,139.83 99.94,139.96 0,139.96
GND on Bottom Layer: 0.11,89.18 48.36,89.18 49.78,87.76 49.78,83.84 99.8,83.84 99.82,139.83 99.94,139.96 0,139.96
GND on GND: 0.26,139.74 99.74,139.74 99.74,0.26 0.26,0.26
$2N2169 on Top Layer: 71.11,50.55 80.39,50.55 80.39,65.35 75.16,65.35 75.16,74.05 71.11,74.05
$2N2174 on Top Layer: -0.64,44.08 99.82,44.08 99.82,36.27 -0.64,36.27
$2N2174 on Bottom Layer: -0.64,44.08 99.82,44.08 99.82,36.27 -0.64,36.27
$2N2175 on Top Layer: 53.84,50.55 63.11,50.55 63.11,65.35 57.88,65.35 57.88,74.05 53.84,74.05
$2N7268 on Bottom Layer: 13.71,52.46 29.97,52.46 29.97,46.62 13.71,46.62
$2N17357 on Top Layer: 88.39,50.55 97.66,50.55 97.66,65.35 92.43,65.35 92.43,74.05 88.39,74.05
$2N17880 on Bottom Layer: 36.57,52.46 51.94,52.46 51.94,46.62 36.57,46.62
$2N17880 on Bottom Layer: 47.14,64.38 100,64.38 100,52.01 47.14,52.01

Small or netless copper shapes (teardrops, artwork), in the pictures only: 101 on Top Layer, 51 on GND, 15 on 3V3

## Text on the board
Top Layer: Copyright Simon Pilot 2024 / ESP32-S3 BrewPILess V1 Rev 1 / Suits Jaycar Enclosure HB6219
Top Silkscreen Layer: VCC | 3V3 | RESET | GND | GPIO 0 / DOWNLOAD | RTD | 14 DS18B20 3.3V+ | 14 DS18B20 SIG | 14 DS18B20 - | 15 DO 5V+ | 15 DO - | 16 DO 5V+ | 16 DO - | 17 DO 5V+ | 17 DO - | 7 DO ACTIVE | 7 DO ACTIVE SWITCHED | 7 DO NEUTRAL | 6 DO ACTIVE | 6 DO ACTIVE SWITCHED | 6 DO NEUTRAL | 5 DO ACTIVE | 5 DO ACTIVE SWITCHED | 5 DO NEUTRAL
